# EAGLE design PSPS_AVNC_SRD_central-2020-11-2 (FABRICATED) (EAGLE 9.6.2)
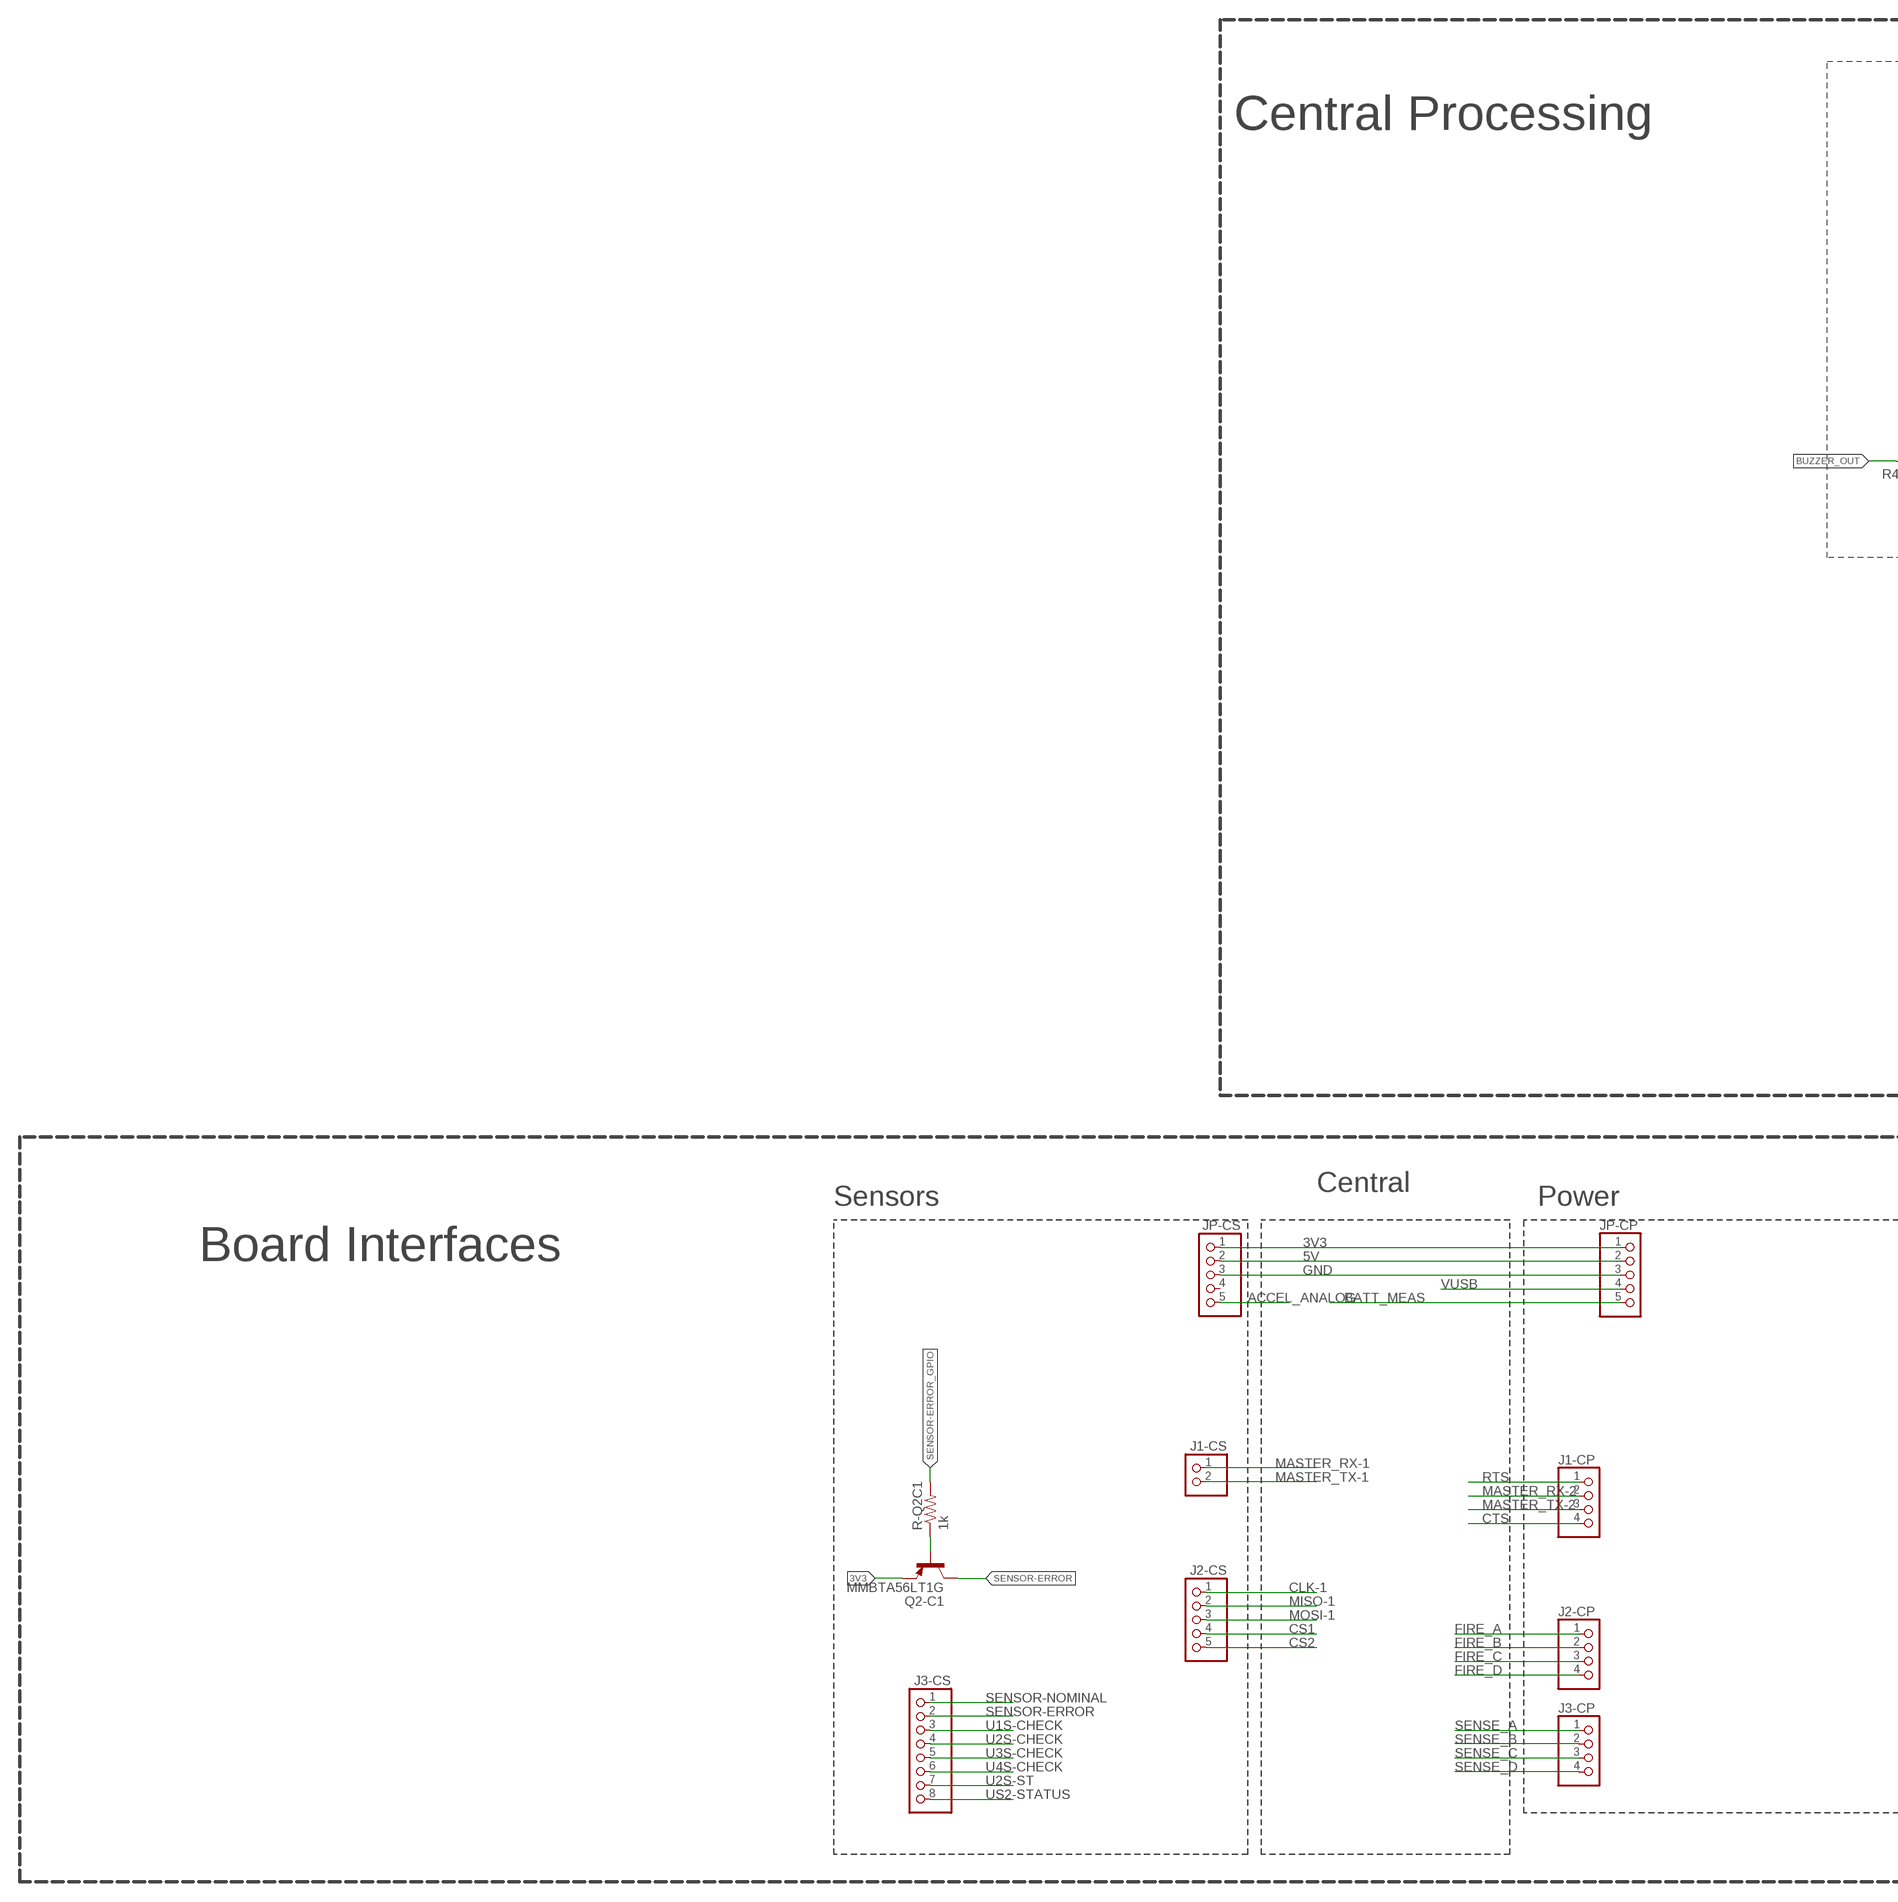
[diagram p0: schematic, sheet 1, part 1 of 2]
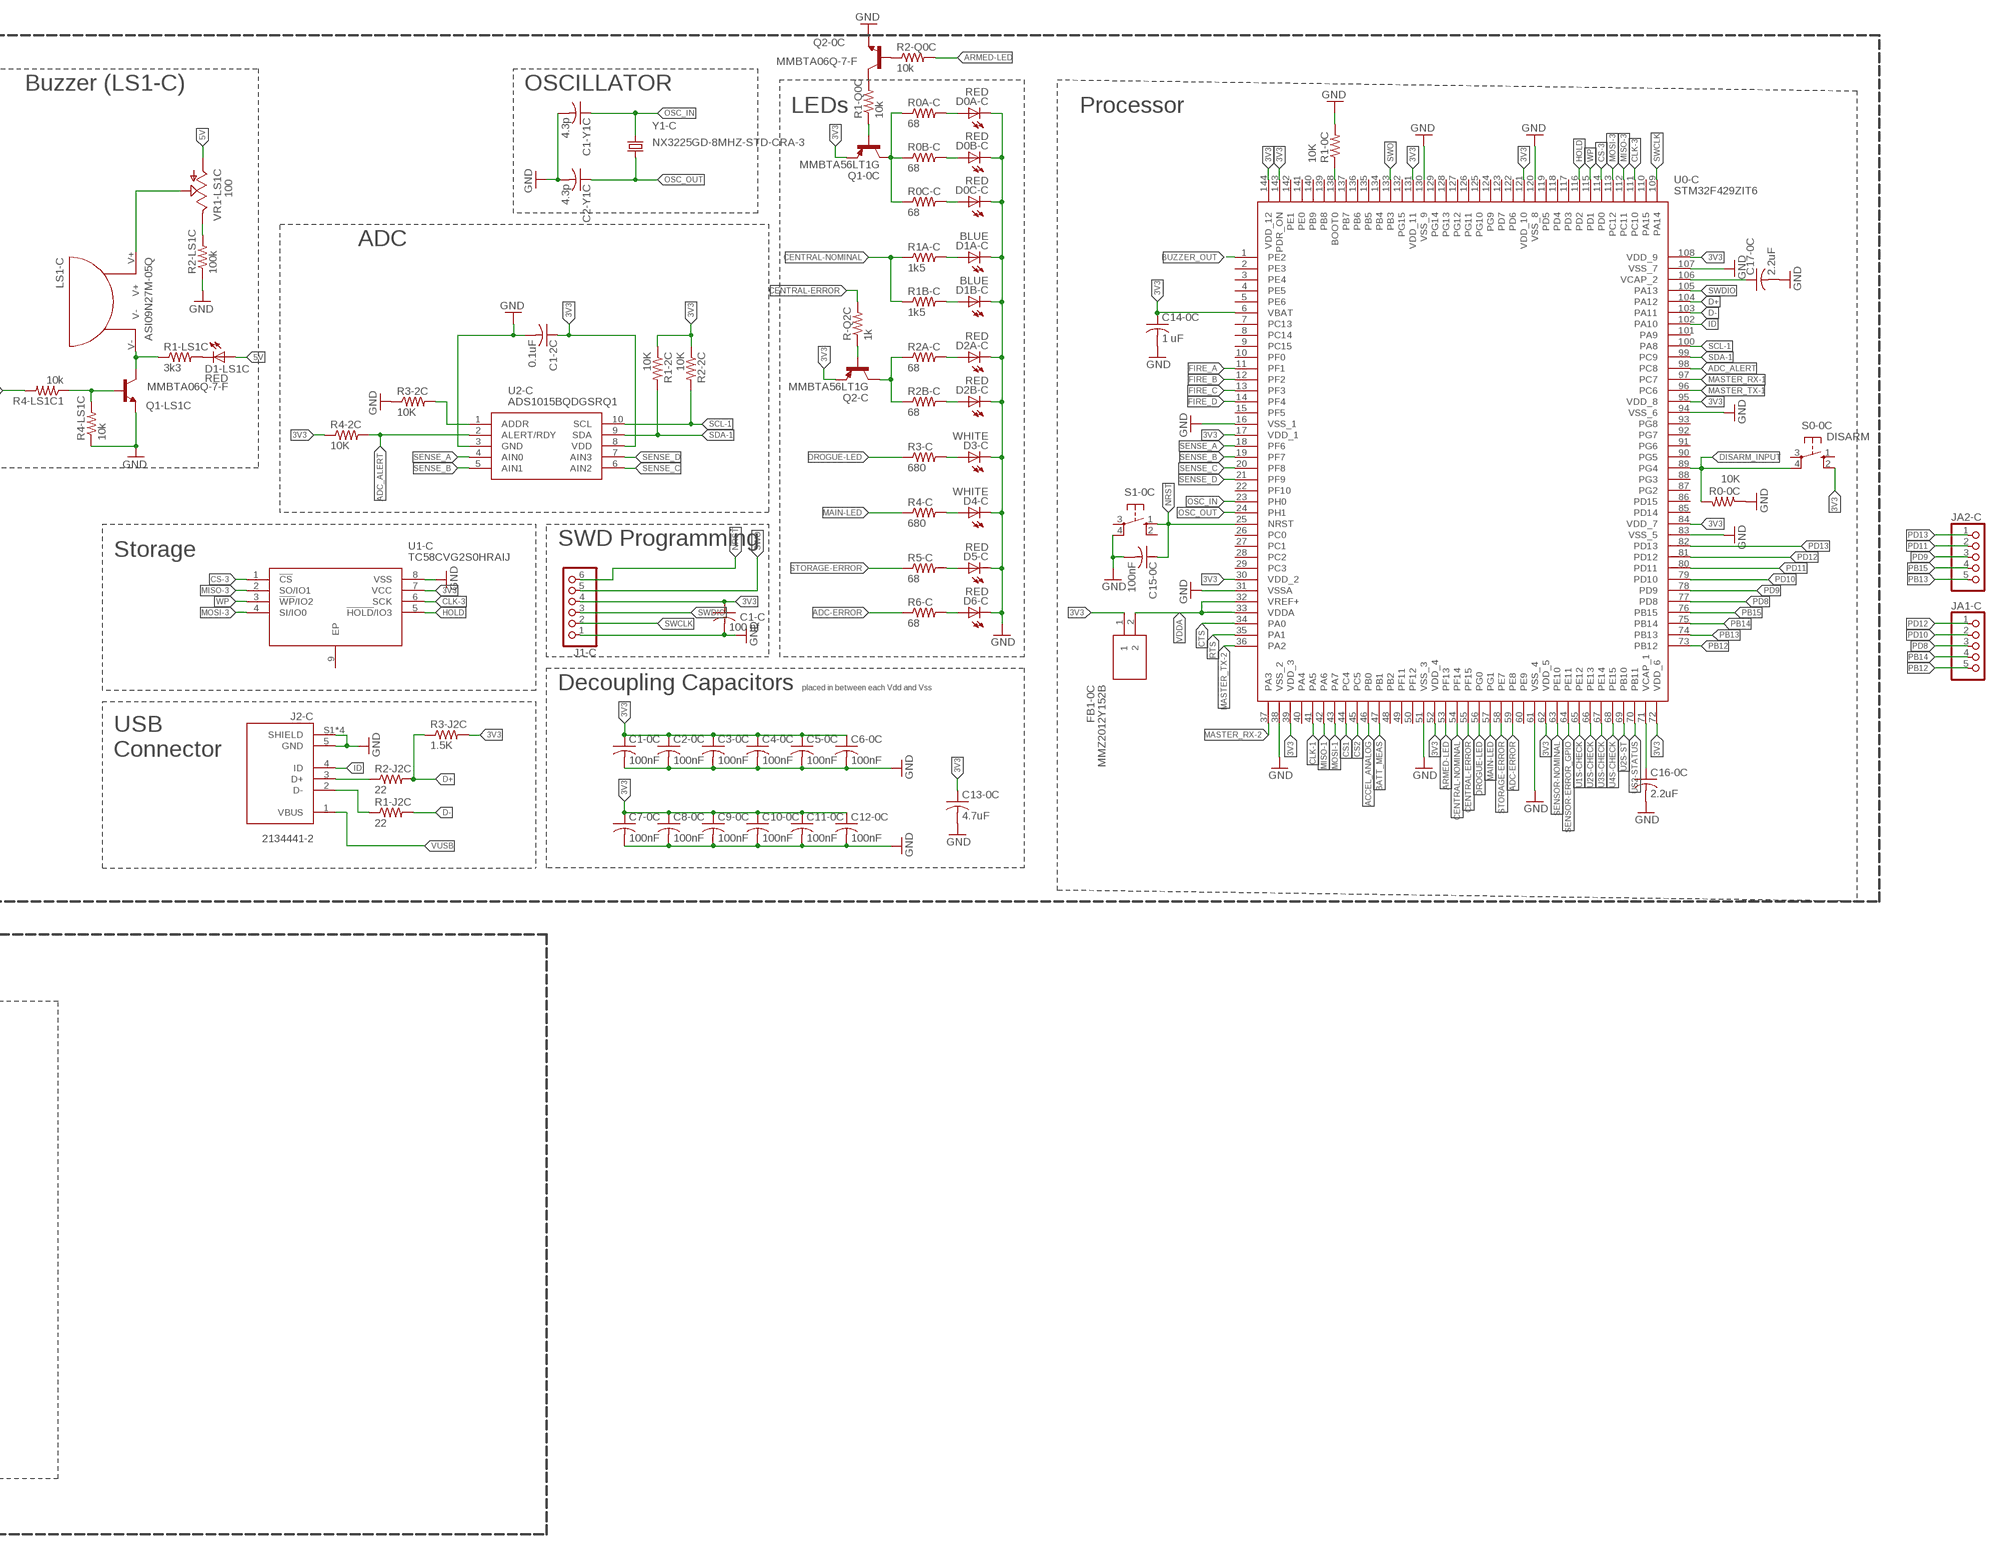
[diagram p1: schematic, sheet 1, part 2 of 2]

## Parts
C1-0C  100nF  C-USC0805  [C0805]
C1-2C  0.1uF  C-USC0805  [C0805]
C1-C  100 nf  C-USC0805  [C0805]
C1-Y1C  4.3p  C-USC0805  [C0805]
C2-0C  100nF  C-USC0805  [C0805]
C2-Y1C  4.3p  C-USC0805  [C0805]
C3-0C  100nF  C-USC0805  [C0805]
C4-0C  100nF  C-USC0805  [C0805]
C5-0C  100nF  C-USC0805  [C0805]
C6-0C  100nF  C-USC0805  [C0805]
C7-0C  100nF  C-USC0805  [C0805]
C8-0C  100nF  C-USC0805  [C0805]
C9-0C  100nF  C-USC0805  [C0805]
C10-0C  100nF  C-USC0805  [C0805]
C11-0C  100nF  C-USC0805  [C0805]
C12-0C  100nF  C-USC0805  [C0805]
C13-0C  4.7uF  C-USC0805  [C0805]
C14-0C  1 uF  C-USC0805  [C0805]
C15-0C  100nF  C-USC0805  [C0805]
C16-0C  2.2uF  C-USC0805  [C0805]
C17-0C  2.2uF  C-USC0805  [C0805]
D0A-C  RED  LEDCHIPLED_0805  [CHIPLED_0805]
D0B-C  RED  LEDCHIPLED_0805  [CHIPLED_0805]
D0C-C  RED  LEDCHIPLED_0805  [CHIPLED_0805]
D1-LS1C  RED  LEDCHIPLED_0805  [CHIPLED_0805]
D1A-C  BLUE  LEDCHIPLED_0805  [CHIPLED_0805]
D1B-C  BLUE  LEDCHIPLED_0805  [CHIPLED_0805]
D2A-C  RED  LEDCHIPLED_0805  [CHIPLED_0805]
D2B-C  RED  LEDCHIPLED_0805  [CHIPLED_0805]
D3-C  WHITE  LEDCHIPLED_0805  [CHIPLED_0805]
D4-C  WHITE  LEDCHIPLED_0805  [CHIPLED_0805]
D5-C  RED  LEDCHIPLED_0805  [CHIPLED_0805]
D6-C  RED  LEDCHIPLED_0805  [CHIPLED_0805]
FB1-0C  MMZ2012Y152B  [BEADC2012X105N]
J1-C  PINHD-1X6  [1X06]
J1-CP  PINHD-1X4  [1X04]
J1-CS  PINHD-1X2  [1X02]
J2-C  2134441-2  [TE_2134441-2]
J2-CP  PINHD-1X4  [1X04]
J2-CS  PINHD-1X5  [1X05]
J3-CP  PINHD-1X4  [1X04]
J3-CS  PINHD-1X8  [1X08]
JA1-C  PINHD-1X5  [1X05]
JA2-C  PINHD-1X5  [1X05]
JP-CP  PINHD-1X5  [1X05]
JP-CS  PINHD-1X5  [1X05]
LS1-C  ASI09N27M-05Q  [ASI09N27M-05Q]
Q1-0C  MMBTA56LT1G  PNP_TRANSISTOR  [SOT23]
Q1-LS1C  MMBTA06Q-7-F  NPN_TRANSISTOR  [SOT23]
Q2-0C  MMBTA06Q-7-F  NPN_TRANSISTOR  [SOT23]
Q2-C  MMBTA56LT1G  PNP_TRANSISTOR  [SOT23]
Q2-C1  MMBTA56LT1G  PNP_TRANSISTOR  [SOT23]
R0-0C  10K  R-US_R0805  [R0805]
R0A-C  68  R-US_M0805  [M0805]
R0B-C  68  R-US_M0805  [M0805]
R0C-C  68  R-US_M0805  [M0805]
R1-0C  10K  R-US_R0805  [R0805]
R1-2C  10K  R-US_R0805  [R0805]
R1-J2C  22  R-US_M0805  [M0805]
R1-LS1C  3k3  R-US_R0805  [R0805]
R1-Q0C  10k  R-US_M0805  [M0805]
R1A-C  1k5  R-US_M0805  [M0805]
R1B-C  1k5  R-US_M0805  [M0805]
R2-2C  10K  R-US_R0805  [R0805]
R2-J2C  22  R-US_M0805  [M0805]
R2-LS1C  100k  R-US_R0805  [R0805]
R2-Q0C  10k  R-US_M0805  [M0805]
R2A-C  68  R-US_M0805  [M0805]
R2B-C  68  R-US_M0805  [M0805]
R3-2C  10K  R-US_R0805  [R0805]
R3-C  680  R-US_M0805  [M0805]
R3-J2C  1.5K  R-US_M0805  [M0805]
R4-2C  10K  R-US_R0805  [R0805]
R4-C  680  R-US_M0805  [M0805]
R4-LS1C  10k  R-US_R0805  [R0805]
R4-LS1C1  10k  R-US_R0805  [R0805]
R5-C  68  R-US_M0805  [M0805]
R6-C  68  R-US_M0805  [M0805]
R-Q2C  1k  R-US_M0805  [M0805]
R-Q2C1  1k  R-US_M0805  [M0805]
S0-0C  DISARM  10-XX  [B3F-10XX]
S1-0C  10-XX  [B3F-10XX]
U0-C  STM32F429ZIT6  [QFP50P2200X2200X160-144N]
U1-C  TC58CVG2S0HRAIJ  [SON127P800X600X80-9N]
U2-C  ADS1015BQDGSRQ1  [SOP50P490X110-10N]
VR1-LS1C  100  TRIM_US-LI10  [LI10]
Y1-C  NX3225GD-8MHZ-STD-CRA-3  NX3225GD  [NX3225GD]

## Nets
3V3: C1-0C.1 C1-2C.1 C1-C.1 C2-0C.1 C3-0C.1 C4-0C.1 C5-0C.1 C6-0C.1 C7-0C.1 C8-0C.1 C9-0C.1 C10-0C.1 C11-0C.1 C12-0C.1 C13-0C.1 C14-0C.1 FB1-0C.1 J1-C.4 JP-CP.1 JP-CS.1 Q1-0C.2(E) Q2-C1.2(E) Q2-C.2(E) R1-2C.1 R2-2C.1 R3-J2C.2 R4-2C.1 S0-0C.2(S1) U0-C.6(VBAT) U0-C.17(VDD_1) U0-C.30(VDD_2) U0-C.39(VDD_3) U0-C.52(VDD_4) U0-C.62(VDD_5) U0-C.72(VDD_6) U0-C.84(VDD_7) U0-C.95(VDD_8) U0-C.108(VDD_9) U0-C.121(VDD_10) U0-C.131(VDD_11) U0-C.143(PDR_ON) U0-C.144(VDD_12) U1-C.7(VCC) U2-C.8(VDD)
5V: D1-LS1C.A JP-CP.2 JP-CS.2 VR1-LS1C.A
ACCEL_ANALOG: JP-CS.5 U0-C.46(PB0)
ADC-ERROR: R6-C.1 U0-C.59(PE8)
ADC_ALERT: R4-2C.2 U0-C.98(PC8) U2-C.2(ALERT/RDY)
ADDR: R3-2C.2 U2-C.1(ADDR)
ARMED-LED: R2-Q0C.2 U0-C.53(PF13)
BATT_MEAS: JP-CP.5 U0-C.47(PB1)
BOOT0: R1-0C.1 U0-C.138(BOOT0)
BUZZER_OUT: R4-LS1C1.2 U0-C.1(PE2)
CENTRAL-ERROR: R-Q2C.2 U0-C.55(PF15)
CENTRAL-NOMINAL: R1A-C.1 R1B-C.1 U0-C.54(PF14)
CLK-1: J2-CS.1 U0-C.41(PA5)
CLK-3: U0-C.111(PC10) U1-C.6(SCK)
CS1: J2-CS.4 U0-C.44(PC4)
CS2: J2-CS.5 U0-C.45(PC5)
CS-3: U0-C.114(PD0) U1-C.1(!CS)
CTS: J1-CP.4 U0-C.34(PA0)
D1-LS1C_R1-LS1C: D1-LS1C.C R1-LS1C.2
D+: R2-J2C.2 R3-J2C.1 U0-C.104(PA12)
D+_R2-J1C: J2-C.3(D+) R2-J2C.1
D-: R1-J2C.2 U0-C.103(PA11)
D-_R1-J1C: J2-C.2(D-) R1-J2C.1
DISARM_INPUT: R0-0C.2 S0-0C.4(P1) U0-C.89(PG4)
DROGUE-LED: R3-C.1 U0-C.56(PG0)
FIRE_A: J2-CP.1 U0-C.11(PF1)
FIRE_B: J2-CP.2 U0-C.12(PF2)
FIRE_C: J2-CP.3 U0-C.13(PF3)
FIRE_D: J2-CP.4 U0-C.14(PF4)
GND: C1-0C.2 C1-2C.2 C1-C.2 C1-Y1C.2 C2-0C.2 C2-Y1C.2 C3-0C.2 C4-0C.2 C5-0C.2 C6-0C.2 C7-0C.2 C8-0C.2 C9-0C.2 C10-0C.2 C11-0C.2 C12-0C.2 C13-0C.2 C14-0C.2 C15-0C.2 C16-0C.2 C17-0C.2 D0A-C.C D0B-C.C D0C-C.C D1A-C.C D1B-C.C D2A-C.C D2B-C.C D3-C.C D4-C.C D5-C.C D6-C.C J1-C.1 J2-C.5(GND) J2-C.S1(SHIELD) J2-C.S2(SHIELD) J2-C.S3(SHIELD) J2-C.S4(SHIELD) JP-CP.3 JP-CS.3 Q1-LS1C.3(E) Q2-0C.3(E) R0-0C.1 R1-0C.2 R2-LS1C.1 R3-2C.1 R4-LS1C.1 S1-0C.4(P1) U0-C.16(VSS_1) U0-C.31(VSSA) U0-C.38(VSS_2) U0-C.51(VSS_3) U0-C.61(VSS_4) U0-C.83(VSS_5) U0-C.94(VSS_6) U0-C.107(VSS_7) U0-C.120(VSS_8) U0-C.130(VSS_9) U1-C.8(VSS) U2-C.3(GND)
HOLD: U0-C.116(PD2) U1-C.5(!HOLD!/IO3)
ID: J2-C.4(ID) U0-C.102(PA10)
LS1-C_Q1-LS1C: LS1-C.V- Q1-LS1C.2(C) R1-LS1C.1
MAIN-LED: R4-C.1 U0-C.57(PG1)
MASTER_RX-1: J1-CS.1 U0-C.97(PC7)
MASTER_RX-2: J1-CP.2 U0-C.37(PA3)
MASTER_TX-1: J1-CS.2 U0-C.96(PC6)
MASTER_TX-2: J1-CP.3 U0-C.36(PA2)
MISO-1: J2-CS.2 U0-C.42(PA6)
MISO-3: U0-C.112(PC11) U1-C.2(SO/IO1)
MOSI-1: J2-CS.3 U0-C.43(PA7)
MOSI-3: U0-C.113(PC12) U1-C.4(SI/IO0)
N$7: Q2-C1.1(B) R-Q2C1.1
NRST: C15-0C.1 J1-C.6 S1-0C.1(S) U0-C.25(NRST)
OSC_IN: C1-Y1C.1 U0-C.23(PH0) Y1-C.P$2
OSC_OUT: C2-Y1C.1 U0-C.24(PH1) Y1-C.P$1
PB12: JA1-C.5 U0-C.73(PB12)
PB13: JA2-C.5 U0-C.74(PB13)
PB14: JA1-C.4 U0-C.75(PB14)
PB15: JA2-C.4 U0-C.76(PB15)
PD8: JA1-C.3 U0-C.77(PD8)
PD9: JA2-C.3 U0-C.78(PD9)
PD10: JA1-C.2 U0-C.79(PD10)
PD11: JA2-C.2 U0-C.80(PD11)
PD12: JA1-C.1 U0-C.81(PD12)
PD13: JA2-C.1 U0-C.82(PD13)
Q0-C_R0-C: Q1-0C.3(C) R0A-C.1 R0B-C.1 R0C-C.1
Q1-0C_R-1Q0C: Q1-0C.1(B) R1-Q0C.1
Q2-C_R2-C: Q2-C.3(C) R2A-C.1 R2B-C.1
R0A-C_D0A-C: D0A-C.A R0A-C.2
R0B-C_D0B-C: D0B-C.A R0B-C.2
R0C-C_D0C-C: D0C-C.A R0C-C.2
R1-Q0C_Q2-0C: Q2-0C.2(C) R1-Q0C.2
R1A-C_D1A-C: D1A-C.A R1A-C.2
R1B-C_D1B-C: D1B-C.A R1B-C.2
R2-LS1C_LS1C: LS1-C.V+ VR1-LS1C.S
R2-Q0C_Q2-0C: Q2-0C.1(B) R2-Q0C.1
R2A-C_D2A-C: D2A-C.A R2A-C.2
R2B-C_D2B-C: D2B-C.A R2B-C.2
R3-C_D3-C: D3-C.A R3-C.2
R3-LS1C_Q1-LS1C: Q1-LS1C.1(B) R4-LS1C1.1 R4-LS1C.2
R4-C_D4-C: D4-C.A R4-C.2
R5-C_D5-C: D5-C.A R5-C.2
R6-C_D6-C: D6-C.A R6-C.2
R-Q2C_Q2-C: Q2-C.1(B) R-Q2C.1
RTS: J1-CP.1 U0-C.35(PA1)
SCL-1: R2-2C.2 U0-C.100(PA8) U2-C.10(SCL)
SDA-1: R1-2C.2 U0-C.99(PC9) U2-C.9(SDA)
SENSE_A: J3-CP.1 U0-C.18(PF6) U2-C.4(AIN0)
SENSE_B: J3-CP.2 U0-C.19(PF7) U2-C.5(AIN1)
SENSE_C: J3-CP.3 U0-C.20(PF8) U2-C.6(AIN2)
SENSE_D: J3-CP.4 U0-C.21(PF9) U2-C.7(AIN3)
SENSOR-ERROR: J3-CS.2 Q2-C1.3(C)
SENSOR-ERROR_GPIO: R-Q2C1.2 U0-C.64(PE11)
SENSOR-NOMINAL: J3-CS.1 U0-C.63(PE10)
STORAGE-ERROR: R5-C.1 U0-C.58(PE7)
SWCLK: J1-C.2 U0-C.109(PA14)
SWDIO: J1-C.3 U0-C.105(PA13)
SWO: J1-C.5 U0-C.133(PB3)
U1S-CHECK: J3-CS.3 U0-C.65(PE12)
U2S-CHECK: J3-CS.4 U0-C.66(PE13)
U2S-ST: J3-CS.7 U0-C.69(PB10)
U3S-CHECK: J3-CS.5 U0-C.67(PE14)
U4S-CHECK: J3-CS.6 U0-C.68(PE15)
US2-STATUS: J3-CS.8 U0-C.70(PB11)
VCAP_1: C16-0C.1 U0-C.71(VCAP_1)
VCAP_2: C17-0C.1 U0-C.106(VCAP_2)
VDDA: FB1-0C.2 U0-C.32(VREF+) U0-C.33(VDDA)
VR1-LS1C_R3-LS1C: R2-LS1C.2 VR1-LS1C.E
VUSB: J2-C.1(VBUS) JP-CP.4
WP: U0-C.115(PD1) U1-C.3(!WP!/IO2)
Unconnected: JP-CS.4 S0-0C.1(S) S0-0C.3(P) S1-0C.2(S1) S1-0C.3(P) U0-C.2(PE3) U0-C.3(PE4) U0-C.4(PE5) U0-C.5(PE6) U0-C.7(PC13) U0-C.8(PC14) U0-C.9(PC15) U0-C.10(PF0) U0-C.15(PF5) U0-C.22(PF10) U0-C.26(PC0) U0-C.27(PC1) U0-C.28(PC2) U0-C.29(PC3) U0-C.40(PA4) U0-C.48(PB2) U0-C.49(PF11) U0-C.50(PF12) U0-C.60(PE9) U0-C.85(PD14) U0-C.86(PD15) U0-C.87(PG2) U0-C.88(PG3) U0-C.90(PG5) U0-C.91(PG6) U0-C.92(PG7) U0-C.93(PG8) U0-C.101(PA9) U0-C.110(PA15) U0-C.117(PD3) U0-C.118(PD4) U0-C.119(PD5) U0-C.122(PD6) U0-C.123(PD7) U0-C.124(PG9) U0-C.125(PG10) U0-C.126(PG11) U0-C.127(PG12) U0-C.128(PG13) U0-C.129(PG14) U0-C.132(PG15) U0-C.134(PB4) U0-C.135(PB5) U0-C.136(PB6) U0-C.137(PB7) U0-C.139(PB8) U0-C.140(PB9) U0-C.141(PE0) U0-C.142(PE1) U1-C.9(EP)

## Notes on the sheet
- Buzzer (LS1-C) | OSCILLATOR
- LEDs | Processor
- Central Processing
- ADC
- SWD Programming
- Storage
- Decoupling Capacitors | placed in between each Vdd and Vss
- USB 
  Connector
- Central
- Sensors | Power
- Board Interfaces

## Library data of the parts
C1-0C C1-2C C1-C C1-Y1C C2-0C C2-Y1C C3-0C C4-0C C5-0C C6-0C C7-0C C8-0C C9-0C C10-0C C11-0C C12-0C C13-0C C14-0C C15-0C C16-0C C17-0C = rcl:C-US: CAPACITOR, American symbol; SPICEPREFIX: C
D0A-C D0B-C D0C-C D1-LS1C D1A-C D1B-C D2A-C D2B-C D3-C D4-C D5-C D6-C = adafruit:LED: LED OSRAM: - CHIPLED LG R971, LG N971, LY N971, LG Q971, LY Q971, LO R971, LY R971 LH N974, LH R974 LS Q976, LO Q976, LY Q976 LO Q996 - Hyper CHIPLED LW Q18S LB Q993, LB Q99A, LB R99A - SideLED LS A670, LO A670, LY A670, LG A670, LP A670 LB A673, LV A673, LT A673, LW A673 LH A674 LY A675 LS A676, LA A676, LO A676, LY A676, LW A676 LS A679, LY A679, LG A679 - Hyper Micro SIDELED® LS Y876, LA Y876, LO Y876, LY Y876 LT Y87S - SmartLED LW L88C, LW L88S LB L89C, LB L89S, LG L890 LS L89K, LO L89K, LY L89K LS L896, LA L896, LO L896, LY L896 - TOPLED LS T670, LO T670, LY T670, LG T670, LP T670 LSG T670, LSP T670, LSY T670, LOP T670, LYG T670 LG T671, LOG T671, LSG T671 LB T673, LV T673, LT T673, LW T673 LH T674 LS T676, LA T676, LO T676, LY T676, LB T676, LH T676, LSB T676, LW T676 LB T67C, LV T67C, LT T67C, LS T67K, LO T67K, LY T67K, LW E67C LS E67B, LA E67B, LO E67B, LY E67B, LB E67C, LV E67C, LT E67C LW T67C LS T679, LY T679, LG T679 LS T770, LO T770, LY T770, LG T770, LP T770 LB T773, LV T773, LT T773, LW T773 LH T774 LS E675, LA E675, LY E675, LS T675 LS T776, LA T776, LO T776, LY T776, LB T776 LHGB T686 LT T68C, LB T68C - Hyper Mini TOPLED® LB M676 - Mini TOPLED Santana® LG M470 LS M47K, LO M47K, LY M47K Source: http://www.osram.convergy.de/
FB1-0C = SamacSys_Parts:MMZ2012Y152B: Ferrite bead SMD 1500Ohm 500mA TDK Ferrite Bead (Chip Bead), 2 x 1.25 x 0.85mm (0805) Source: Datasheet <https://componentsearchengine.com/Datasheets/1/MMZ2012Y152B.pdf>; DESCRIPTION: Ferrite bead SMD 1500Ohm 500mA TDK Ferrite Bead (Chip Bead), 2 x 1.25 x 0.85mm (0805); HEIGHT: 1.05mm; MANUFACTURER_NAME: TDK; MANUFACTURER_PART_NUMBER: MMZ2012Y152B; MOUSER_PART_NUMBER: 810-MMZ2012Y152B; MOUSER_PRICE-STOCK: https://www.mouser.com/Search/Refine.aspx?Keyword=810-MMZ2012Y152B
J1-C = pinhead:PINHD-1X6: PIN HEADER
J1-CP J2-CP J3-CP = pinhead:PINHD-1X4: PIN HEADER
J1-CS = pinhead:PINHD-1X2: PIN HEADER
J2-C = 2134441-2:2134441-2: Conn Micro USB RCP 5 POS 0.65mm Solder RA SMD 5 Terminal 1 Port T/R; COMMENT: 2134441-2; DESCRIPTION: Conn Micro USB RCP 5 POS 0.65mm Solder RA SMD 5 Terminal 1 Port T/R; DIGI-KEY_PART_NUMBER: A118104CT-ND; DIGI-KEY_PURCHASE_URL: https://www.digikey.com/product-detail/en/te-connectivity-amp-connectors/2134441-2/A118104CT-ND/4729911?utm_source=snapeda&utm_medium=aggregator&utm_campaign=symbol; MF: TE Connectivity; MP: 2134441-2; PACKAGE: None; TE_PURCHASE_URL: https://www.te.com/usa-en/product-2134441-2.html?te_bu=Cor&te_type=disp&te_campaign=seda_glo_cor-seda-global-disp-prtnr-fy19-seda-model-bom-cta_sma-317_1&elqCampaignId=32493
J2-CS JA1-C JA2-C JP-CP JP-CS = pinhead:PINHD-1X5: PIN HEADER
J3-CS = pinhead:PINHD-1X8: PIN HEADER
LS1-C = Computer2:ASI09N27M-05Q
Q1-0C Q2-C Q2-C1 = Flight Computer Parts:PNP_TRANSISTOR
Q1-LS1C Q2-0C = Flight Computer Parts:NPN_TRANSISTOR
R0-0C R0A-C R0B-C R0C-C R1-0C R1-2C R1-J2C R1-Q0C R1A-C R1B-C R2-2C R2-J2C R2-Q0C R2A-C R2B-C R3-2C R3-C R3-J2C R4-2C R4-C R5-C R6-C R-Q2C R-Q2C1 = rcl:R-US_: RESISTOR, American symbol; SPICEPREFIX: R
R1-LS1C R2-LS1C R4-LS1C R4-LS1C1 = resistor:R-US_: RESISTOR, American symbol
S0-0C S1-0C = switch-omron:10-XX: OMRON SWITCH; MPN: B3F-1000; OC_FARNELL: 176432; OC_NEWARK: 36M3542
U0-C = SamacSys_Parts:STM32F429ZIT6: 32-Bit MCU+FPU M4 2MB LCD-TFT LQFP144 STMicroelectronics STM32F429ZIT6, 32bit ARM Cortex M4 MCU, 180MHz, 2048 kB Flash, 144-Pin LQFP Source: Datasheet <https://componentsearchengine.com/Datasheets/1/STM32F429ZIT6.pdf>; DESCRIPTION: 32-Bit MCU+FPU M4 2MB LCD-TFT LQFP144 STMicroelectronics STM32F429ZIT6, 32bit ARM Cortex M4 MCU, 180MHz, 2048 kB Flash, 144-Pin LQFP; HEIGHT: 1.6mm; MANUFACTURER_NAME: STMicroelectronics; MANUFACTURER_PART_NUMBER: STM32F429ZIT6; MOUSER_PART_NUMBER: 511-STM32F429ZIT6; MOUSER_PRICE-STOCK: https://www.mouser.com/Search/Refine.aspx?Keyword=511-STM32F429ZIT6
U1-C = SamacSys_Parts:TC58CVG2S0HRAIJ: NAND Flash 4G-bit 128M X 8bit Serial 8-Pin WSON Source: Datasheet <https://business.kioxia.com/en-us/memory/detail.TC58CVG2S0HRAIJ.html>; DESCRIPTION: NAND Flash 4G-bit 128M X 8bit Serial 8-Pin WSON; HEIGHT: 0.8mm; MANUFACTURER_NAME: Kioxia America; MANUFACTURER_PART_NUMBER: TC58CVG2S0HRAIJ; MOUSER_PART_NUMBER: 757-TC58CVG2S0HRAIJ; MOUSER_PRICE-STOCK: https://www.mouser.co.uk/ProductDetail/Kioxia-America/TC58CVG2S0HRAIJ?qs=OlC7AqGiEDkQEWU%2FaAG3Ug%3D%3D
U2-C = SamacSys_Parts:ADS1015BQDGSRQ1: Automotive 12-Bit 3.3kSPS 4-Ch Delta-Sigma ADC With PGA, Oscillator, VREF, Comparator, and I2C Source: Datasheet <http://www.ti.com/lit/gpn/ads1015-q1>; DESCRIPTION: Automotive 12-Bit 3.3kSPS 4-Ch Delta-Sigma ADC With PGA, Oscillator, VREF, Comparator, and I2C; HEIGHT: 1.1mm; MANUFACTURER_NAME: Texas Instruments; MANUFACTURER_PART_NUMBER: ADS1015BQDGSRQ1; MOUSER_PART_NUMBER: 595-ADS1015BQDGSRQ1; MOUSER_PRICE-STOCK: https://www.mouser.com/Search/Refine.aspx?Keyword=595-ADS1015BQDGSRQ1
VR1-LS1C = pot:TRIM_US-: POTENTIOMETER
Y1-C = MarkParts:NX3225GD

## Board
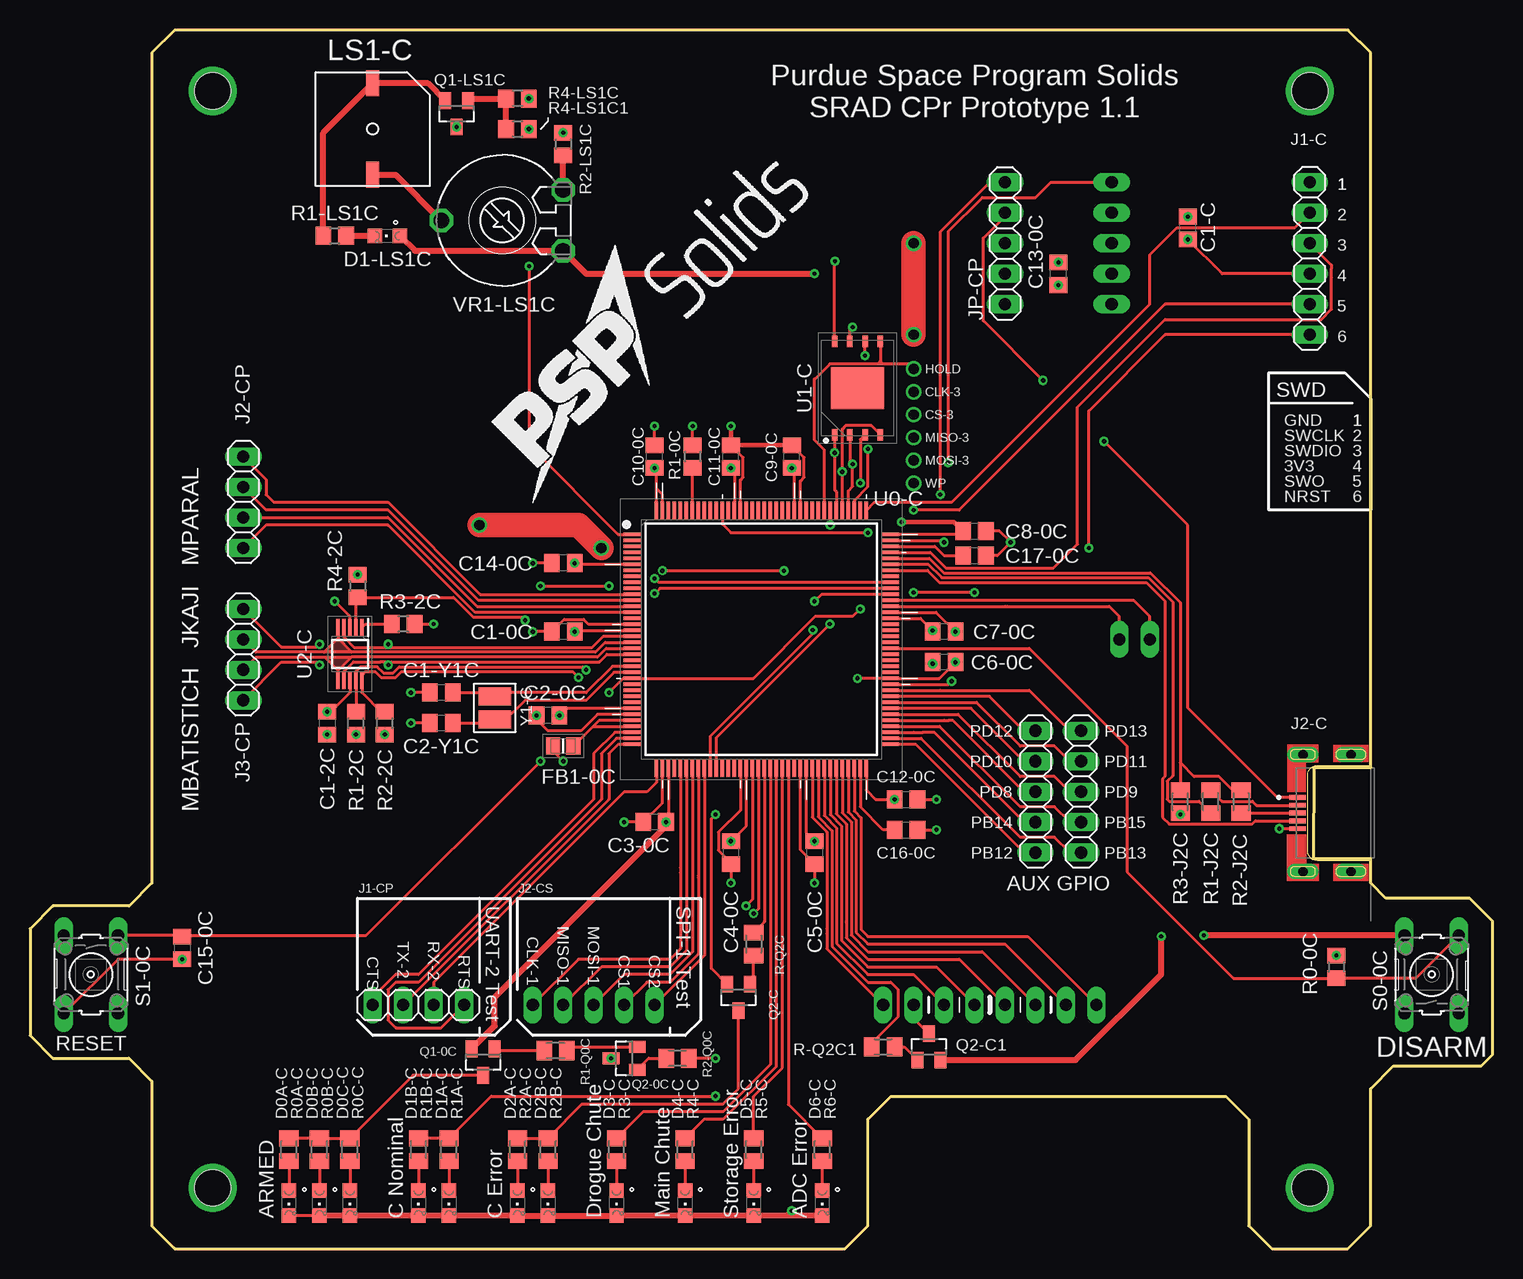
[diagram p2: board, top side]
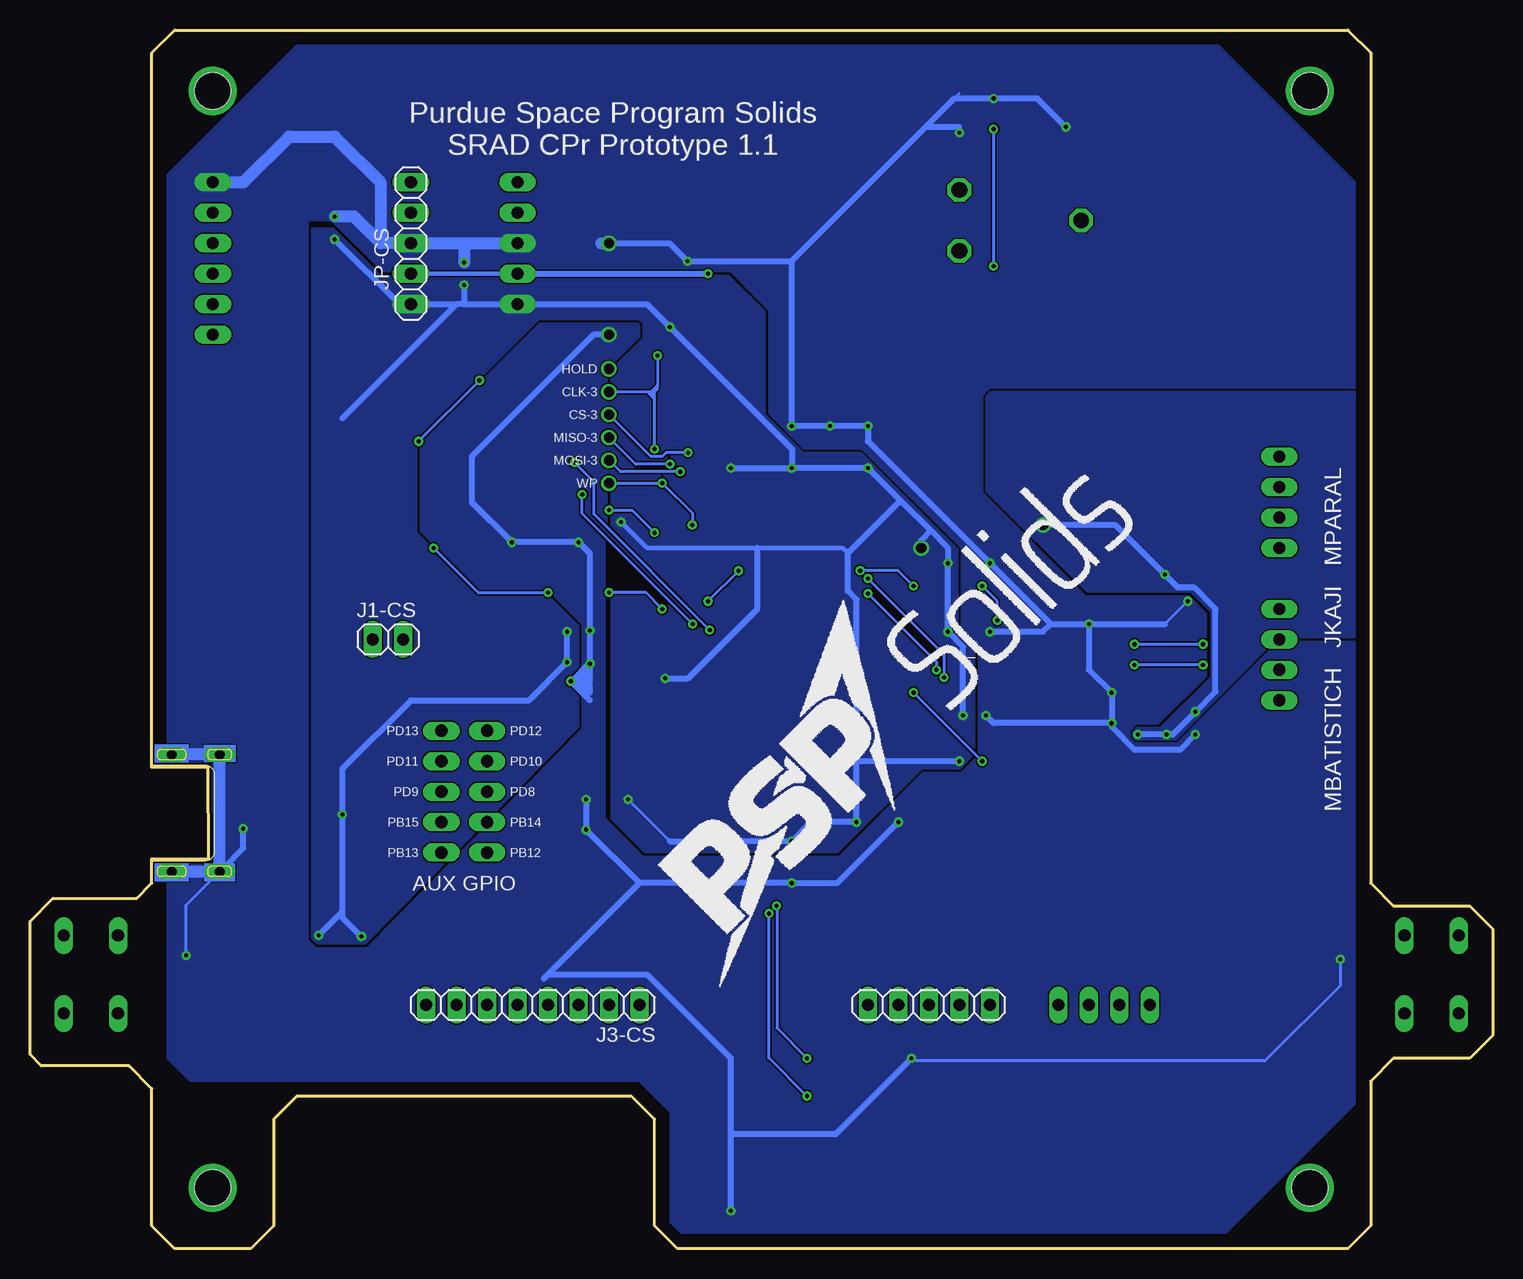
[diagram p3: board, bottom side, seen from below]

Size 121.92 x 101.6 mm. Coordinates in mm from the lower left corner, seen from the top.
Outline: 10.16,1.91 12.06,0 67.94,0 69.85,1.91 69.85,10.79 71.75,12.7 99.69,12.7 101.6,10.79 101.6,1.91 103.5,0 109.85,0 111.76,1.91 111.76,13.34 113.66,15.24 120.97,15.24 121.92,16.19 121.92,27.3 120.02,29.21 113.03,29.21 111.76,30.48 111.76,32.51 107.02,32.51 107.05,40.13 111.78,40.13 111.76,99.69 109.85,101.6 12.06,101.6 10.16,99.69 10.16,30.48 8.26,28.57 1.9,28.57 0,26.67 0,17.78 1.9,15.88 8.26,15.88 10.16,13.97 10.16,1.91
Copper layers (1*16): Top 0.035mm / dielectric 1.5mm / Bottom 0.035mm
Design rules "default *": minimum track width 6mil, minimum drill 0.35mm, track to track 5mil, track to pad 5mil, pad to pad 5mil, via to via 5mil, smd to smd 5mil, copper to edge 10mil, drill to drill 6mil, minimum pad ring 10mil, minimum via ring 8mil, stop-mask expansion 4mil, vias tented up to drill 0mil, thermal gap 10mil
Holes 3 mm at 15.24,96.52 106.68,96.52 106.68,5.08 15.24,5.08

### Footprints (pad centres in the part's own frame; a part is rotated, then mirrored left to right if it is on the bottom)
C0805 = smd 1.3 x 1.5: 1 -0.95,0; 2 0.95,0
CHIPLED_0805 = smd 1.2 x 1.2: A 0,-1.05; C 0,1.05
BEADC2012X105N = smd 1.2 x 1.45: 1 -0.85,0; 2 0.85,0
1X06 = drill 1.016 long: 1 -6.35,0; 2 -3.81,0; 3 -1.27,0; 4 1.27,0; 5 3.81,0; 6 6.35,0
1X04 = drill 1.016 long: 1 -3.81,0; 2 -1.27,0; 3 1.27,0; 4 3.81,0
1X02 = drill 1.016 long: 1 -1.27,0; 2 1.27,0
TE_2134441-2 = smd 1.4 x 0.4: 1 -4.45,1.3; 2 -4.45,0.65; 3 -4.45,0; 4 -4.45,-0.65; 5 -4.45,-1.3 | drill 0.8 pad 1.25 long: S1 -4,-4.875; S2 0,-4.875; S3 0,4.875; S4 -4,4.875
1X05 = drill 1.016 long: 1 -5.08,0; 2 -2.54,0; 3 0,0; 4 2.54,0; 5 5.08,0
1X08 = drill 1.016 long: 1 -8.89,0; 2 -6.35,0; 3 -3.81,0; 4 -1.27,0; 5 1.27,0; 6 3.81,0; 7 6.35,0; 8 8.89,0
ASI09N27M-05Q = smd 2.184 x 1.067: V+ 3.81,0; V- -3.81,0
SOT23 = smd 1 x 1.4: 1 -0.95,-1.1; 2 0.95,-1.1; 3 0,1.1
R0805 = smd 1.3 x 1.5: 1 -0.95,0; 2 0.95,0
M0805 = smd 1.3 x 1.6: 1 -0.95,0; 2 0.95,0
B3F-10XX = drill 1.016 long: 1 -3.251,2.261; 2 3.251,2.261; 3 -3.251,-2.261; 4 3.251,-2.261
QFP50P2200X2200X160-144N = smd 1.475 x 0.3: 1 -10.738,8.75; 2 -10.738,8.25; 3 -10.738,7.75; 4 -10.738,7.25; 5 -10.738,6.75; 6 -10.738,6.25; 7 -10.738,5.75; 8 -10.738,5.25; 9 -10.738,4.75; 10 -10.738,4.25; 11 -10.738,3.75; 12 -10.738,3.25; 13 -10.738,2.75; 14 -10.738,2.25; 15 -10.738,1.75; 16 -10.738,1.25; 17 -10.738,0.75; 18 -10.738,0.25; 19 -10.738,-0.25; 20 -10.738,-0.75; 21 -10.738,-1.25; 22 -10.738,-1.75; 23 -10.738,-2.25; 24 -10.738,-2.75; 25 -10.738,-3.25; 26 -10.738,-3.75; 27 -10.738,-4.25; 28 -10.738,-4.75; 29 -10.738,-5.25; 30 -10.738,-5.75; 31 -10.738,-6.25; 32 -10.738,-6.75; 33 -10.738,-7.25; 34 -10.738,-7.75; 35 -10.738,-8.25; 36 -10.738,-8.75; 73 10.738,-8.75; 74 10.738,-8.25; 75 10.738,-7.75; 76 10.738,-7.25; 77 10.738,-6.75; 78 10.738,-6.25; 79 10.738,-5.75; 80 10.738,-5.25; 81 10.738,-4.75; 82 10.738,-4.25; 83 10.738,-3.75; 84 10.738,-3.25; 85 10.738,-2.75; 86 10.738,-2.25; 87 10.738,-1.75; 88 10.738,-1.25; 89 10.738,-0.75; 90 10.738,-0.25; 91 10.738,0.25; 92 10.738,0.75; 93 10.738,1.25; 94 10.738,1.75; 95 10.738,2.25; 96 10.738,2.75; 97 10.738,3.25; 98 10.738,3.75; 99 10.738,4.25; 100 10.738,4.75; 101 10.738,5.25; 102 10.738,5.75; 103 10.738,6.25; 104 10.738,6.75; 105 10.738,7.25; 106 10.738,7.75; 107 10.738,8.25; 108 10.738,8.75 | smd 0.3 x 1.475: 37 -8.75,-10.738; 38 -8.25,-10.738; 39 -7.75,-10.738; 40 -7.25,-10.738; 41 -6.75,-10.738; 42 -6.25,-10.738; 43 -5.75,-10.738; 44 -5.25,-10.738; 45 -4.75,-10.738; 46 -4.25,-10.738; 47 -3.75,-10.738; 48 -3.25,-10.738; 49 -2.75,-10.738; 50 -2.25,-10.738; 51 -1.75,-10.738; 52 -1.25,-10.738; 53 -0.75,-10.738; 54 -0.25,-10.738; 55 0.25,-10.738; 56 0.75,-10.738; 57 1.25,-10.738; 58 1.75,-10.738; 59 2.25,-10.738; 60 2.75,-10.738; 61 3.25,-10.738; 62 3.75,-10.738; 63 4.25,-10.738; 64 4.75,-10.738; 65 5.25,-10.738; 66 5.75,-10.738; 67 6.25,-10.738; 68 6.75,-10.738; 69 7.25,-10.738; 70 7.75,-10.738; 71 8.25,-10.738; 72 8.75,-10.738; 109 8.75,10.738; 110 8.25,10.738; 111 7.75,10.738; 112 7.25,10.738; 113 6.75,10.738; 114 6.25,10.738; 115 5.75,10.738; 116 5.25,10.738; 117 4.75,10.738; 118 4.25,10.738; 119 3.75,10.738; 120 3.25,10.738; 121 2.75,10.738; 122 2.25,10.738; 123 1.75,10.738; 124 1.25,10.738; 125 0.75,10.738; 126 0.25,10.738; 127 -0.25,10.738; 128 -0.75,10.738; 129 -1.25,10.738; 130 -1.75,10.738; 131 -2.25,10.738; 132 -2.75,10.738; 133 -3.25,10.738; 134 -3.75,10.738; 135 -4.25,10.738; 136 -4.75,10.738; 137 -5.25,10.738; 138 -5.75,10.738; 139 -6.25,10.738; 140 -6.75,10.738; 141 -7.25,10.738; 142 -7.75,10.738; 143 -8.25,10.738; 144 -8.75,10.738
SON127P800X600X80-9N = smd 0.95 x 0.45: 1 -3.9,1.905; 2 -3.9,0.635; 3 -3.9,-0.635; 4 -3.9,-1.905; 5 3.9,-1.905; 6 3.9,-0.635; 7 3.9,0.635; 8 3.9,1.905 | smd 3.5 x 4.4: 9 0,0
SOP50P490X110-10N = smd 1.4 x 0.3: 1 -2.2,1; 2 -2.2,0.5; 3 -2.2,0; 4 -2.2,-0.5; 5 -2.2,-1; 6 2.2,-1; 7 2.2,-0.5; 8 2.2,0; 9 2.2,0.5; 10 2.2,1
LI10 = drill 1.321 octagon: A -2.54,-5.08; E 2.54,-5.08; S 0,5.08
NX3225GD = smd 1.5 x 2.7: P$1 -0.95,0; P$2 0.95,0

### Placement (x,y rotation side)
C1-0C  44.45,51.44 180 top
C1-2C  24.77,43.81 270 top
C1-C  96.52,85.09 90 top
C1-Y1C  34.29,46.35 180 top
C2-0C  43.18,44.45 180 top
C2-Y1C  34.29,43.81 180 top
C3-0C  52.07,35.56 180 top
C4-0C  58.42,33.02 270 top
C5-0C  65.41,33.02 270 top
C6-0C  76.2,48.9 180 top
C7-0C  76.2,51.44 180 top
C8-0C  78.74,59.82 0 top
C9-0C  63.5,66.04 90 top
C10-0C  52.07,66.04 90 top
C11-0C  58.42,66.04 90 top
C12-0C  73.03,37.47 0 top
C13-0C  85.72,81.28 90 top
C14-0C  44.45,57.15 180 top
C15-0C  12.7,25.08 270 top
C16-0C  73.03,34.92 0 top
C17-0C  78.74,57.78 0 top
D0A-C  21.59,3.81 180 top
D0B-C  24.13,3.81 180 top
D0C-C  26.67,3.81 180 top
D1-LS1C  29.79,84.43 90 top
D1A-C  34.92,3.81 180 top
D1B-C  32.39,3.81 180 top
D2A-C  40.64,3.81 180 top
D2B-C  43.18,3.81 180 top
D3-C  48.89,3.81 180 top
D4-C  54.61,3.81 180 top
D5-C  60.33,3.81 180 top
D6-C  66.04,3.81 180 top
FB1-0C  44.45,41.91 0 top
J1-C  106.68,82.55 270 top
J1-CP  32.39,20.32 180 top
J1-CS  92.08,50.8 0 bottom
J2-C  110.11,36.32 0 top
J2-CP  17.78,62.23 270 top
J2-CS  46.99,20.32 180 bottom
J3-CP  17.78,49.53 270 top
J3-CS  80.01,20.32 180 bottom
JA1-C  83.82,38.1 270 top
JA2-C  87.63,38.1 270 top
JP-CP  81.28,83.82 90 top
JP-CS  90.17,83.82 90 bottom
LS1-C  28.57,93.34 270 top
Q1-0C  37.78,15.56 180 top
Q1-LS1C  35.56,94.61 180 top
Q2-0C  49.53,15.88 90 top
Q2-C  59.06,20.95 180 top
Q2-C1  74.93,16.83 0 top
R0-0C  108.9,23.5 270 top
R0A-C  21.59,8.26 270 top
R0B-C  24.13,8.26 270 top
R0C-C  26.67,8.26 270 top
R1-0C  55.25,66.04 90 top
R1-2C  27.17,43.81 90 top
R1-J2C  98.42,37.27 270 top
R1-LS1C  25.4,84.45 0 top
R1-Q0C  43.81,16.51 0 top
R1A-C  34.92,8.26 270 top
R1B-C  32.39,8.26 270 top
R2-2C  29.57,43.81 90 top
R2-J2C  100.97,37.27 90 top
R2-LS1C  44.45,92.08 270 top
R2-Q0C  53.97,15.88 0 top
R2A-C  40.64,8.26 270 top
R2B-C  43.18,8.26 270 top
R3-2C  31.11,52.07 180 top
R3-C  48.89,8.26 270 top
R3-J2C  95.88,37.27 270 top
R4-2C  27.3,55.24 270 top
R4-C  54.61,8.26 270 top
R4-LS1C  40.64,95.89 180 top
R4-LS1C1  40.64,93.34 0 top
R5-C  60.33,8.26 270 top
R6-C  66.04,8.26 270 top
R-Q2C  60.33,25.4 90 top
R-Q2C1  71.12,16.83 180 top
S0-0C  116.84,22.86 90 top
S1-0C  5.08,22.86 270 top
U0-C  60.96,50.8 0 top
U1-C  68.98,71.75 90 top
U2-C  26.67,49.58 270 top
VR1-LS1C  39.37,85.72 90 top
Y1-C  38.73,45.09 90 top

### Tracks (layer width: path | path; a pad name or v marks a point on that pad's centre or on a via)
3V3  (via drill 0.35, 0.85)
  Top 0.254: C5-0C.1 64.71,34.66 U0-C.62 | U0-C.17 45.52,51.55 C1-0C.1 | C11-0C.1 58.71,64.8 U0-C.131 | J1-C.4 99.38,81.28 C1-C.1 | U0-C.6 45.5,57.05 C14-0C.1 | U0-C.39 53.21,35.75 C3-0C.1 | U2-C.8 26.67,46.35 25.08,44.77 C1-2C.1 | C8-0C.1 77.52,59.55 U0-C.108 | U0-C.121 63.71,64.88 C9-0C.1 | U0-C.144 52.21,63.36 | 52.21,63.36 52.21,64.95 C10-0C.1 | U0-C.143 52.71,62.86 52.21,63.36 | C4-0C.1 59.71,35.26 U0-C.52 | U0-C.72 69.71,38.24 70.48,37.47 C12-0C.1 | U0-C.95 75.53,53.05 C7-0C.1 | FB1-0C.1 43.6,41.49 v44.45,40.64 | U1-C.7 68.34,76.6 v68.58,76.83 | U0-C.30 44.73,45.05 C2-0C.1 | Q2-C.2 56.8,23.36 56.8,35.84 v57.15,36.2 | C6-0C.1 75.8,47.55 U0-C.84 v68.97,47.55
  Top 0.381: v72.64,60.58 77.03,60.58 C8-0C.1
  Top 0.508: Q1-0C.2 38.73,18.56 38.73,20.95 53.02,35.24 C3-0C.1 | Q2-C1.2 87.16,15.73 94.3,22.86 v94.3,26.04 | S0-0C.2 v97.87,26.11
  Top 1.016: v95.88,36.2 R3-J2C.2
  Top 2.032: v47.62,58.42 45.72,60.33 v37.47,60.33
  Bottom 0.254: C12-0C.1 68.58,33.97 | v57.15,36.2 57.15,35.88 56.83,35.56
  Bottom 0.381: 53.75,58.01 54.16,58.42 61.28,58.42 70.48,58.42 v72.64,60.58
  Bottom 0.508: C1-C.1 91.12,78.74 JP-CS.1 86.36,78.74 | 85.72,78.74 JP-CP.1 70.48,78.74 v68.58,76.83 58.42,66.67 C11-0C.1 | C13-0C.1 85.72,78.74 | 86.36,78.74 95.88,69.22 | 49.37,62.39 C10-0C.1 C11-0C.1 | 49.37,62.39 46.83,59.85 | 46.83,59.85 45.4,58.42 C14-0C.1 C1-0C.1 44.13,50.16 C2-0C.1 | v29.57,42.87 v27.17,42.87 26.66,42.87 C1-2C.1 23.09,46.44 23.09,53.32 24.92,55.14 26.25,55.14 R4-2C.1 31.43,60.33 v37.47,60.33 | 68.58,33.97 C5-0C.1 C4-0C.1 56.83,35.56 C3-0C.1 53.02,40.64 | 46.83,59.85 47.62,59.05 v47.62,58.42 | 53.02,40.64 53.02,54.09 53.75,54.82 53.75,58.01 49.37,62.39 | v44.45,40.64 53.02,40.64 | 85.72,78.74 86.36,78.74 | C9-0C.1 C11-0C.1 | 95.88,28.09 v97.87,26.11 | 95.88,28.09 v95.88,36.2 95.88,40.01 90.17,45.72 80.33,45.72 C6-0C.1 C7-0C.1 | 95.88,28.09 95.88,27.62 v94.3,26.04 | 61.28,58.42 61.28,53.34 67.07,47.55 v68.97,47.55
  other vias: 96.52,84.14 85.72,80.33 58.42,65.09 52.07,65.09 45.4,57.15 27.3,56.2 27.3,56.2 24.77,44.77 53.02,35.56 58.42,33.97 65.41,33.97 72.08,37.47 45.4,51.44 63.5,65.09 44.13,44.45 77.15,48.9 77.15,51.44
  pour Bottom (no thermals): 60.64,77.47 60.64,78.11 63.67,81.12 92.68,81.12 96.65,85.09 98.42,85.09 98.42,25.88 97.95,25.4 93.98,25.4 76.2,43.5 76.2,51.91 78.74,54.45 84.45,54.45 89.69,59.69 89.69,67.31 79.53,77.47
  pour Bottom (no thermals): 60.64,77.77 60.64,69.53 57.47,66.36 52.64,66.36 44.58,58.29 44.58,51.56 43.18,50.16 43.18,41.27 44.45,40.01 47.62,40.01 54.61,33.02 70.64,33.02 73.5,35.88 73.5,58.58 66.67,51.75 66.04,51.75 65.56,51.28 65.09,51.28 65.09,51.59 73.5,60.01 73.5,63.63 73.48,63.66 69.06,63.66 69.06,64.77 67.71,64.77 67.71,65.33 67.94,65.33 68.18,65.72 68.5,65.72 68.5,66.36 68.9,66.36 69.22,66.04 69.69,66.04 69.69,71.6 73.5,71.6 73.5,73.25 70.8,75.88 70.8,77.15 71.42,77.77
  pour Bottom (no thermals): 42.23,63.18 42.23,71.04 41.83,71.44 11.43,71.44 11.43,50.96 17.94,50.96 26.42,42.42 29.72,42.42 29.97,42.67 29.97,43.05 29.59,43.43 27.69,43.43 23.5,47.62 23.5,53.09 25.15,54.74 33.78,54.74
5V  (via drill 0.35)
  Top 0.508: v65.41,81.28 50.8,81.28 46.36,81.28 VR1-LS1C.A 32.09,83.19 D1-LS1C.A
  Bottom 0.381: JP-CP.2 JP-CS.2
  Bottom 0.508: JP-CP.2 v65.41,81.28
ACCEL_ANALOG  (via drill 0.35)
  Top 0.254: U0-C.46 56.71,42.74 65.26,51.29 v65.26,51.58 | v76.54,65.54 76.54,84.8 79.38,87.63 83.82,87.63 85.09,88.9 JP-CS.5
  Bottom 0.254: v76.54,65.54 74.91,63.91 74.91,61.23 v65.26,51.58
ADC-ERROR
  Top 0.254: R6-C.1 63.21,12.04 U0-C.59
ADC_ALERT  (via drill 0.35)
  Top 0.254: U2-C.2 27.17,54.16 R4-2C.2 35.3,54.3 36.95,52.64 41.02,52.64 v41.27,52.39 | U0-C.98 65.98,54.55 v65.41,53.98 | v42.55,55.24 v48.26,55.24 | v52.71,56.52 v62.86,56.52
  Bottom 0.254: v41.27,52.39 41.27,53.98 v42.55,55.24 | v48.26,55.24 49.55,56.54 52.7,56.54 v52.71,56.52 | v62.86,56.52 v65.41,53.98
ADDR
  Top 0.254: U2-C.1 27.96,52.07 R3-2C.2
ARMED-LED  (via drill 0.35)
  Top 0.254: U0-C.53 60.21,29.11 v59.68,28.58 | v57.15,15.88 R2-Q0C.2
  Bottom 0.254: v59.68,28.58 59.68,28.23 59.67,28.21 59.67,18.39 v57.15,15.88
BATT_MEAS  (via drill 0.35)
  Top 0.254: U0-C.47 57.21,42.6 v66.67,52.07 | v75.88,62.87 75.88,84.77 80.01,88.9 JP-CP.5
  Bottom 0.254: v66.67,52.07 75.88,61.28 v75.88,62.87
BOOT0
  Top 0.254: U0-C.138 55.21,65.06 R1-0C.1
BUZZER_OUT  (via drill 0.35)
  Top 0.254: U0-C.1 49.03,59.55 41.59,66.99 v41.59,81.92
  Bottom 0.254: R4-LS1C1.2 v41.59,81.92
  other vias: 41.59,93.34
CENTRAL-ERROR
  Top 0.254: U0-C.55 61.21,27.3 61.21,27.23 R-Q2C.2
CENTRAL-NOMINAL  (via drill 0.35)
  Top 0.254: R1B-C.1 R1A-C.1 38.44,12.72 v57.15,12.72 | U0-C.54 60.71,28.32 v60.33,27.94
  Bottom 0.254: v57.15,12.72 60.33,15.9 v60.33,27.94
CLK-1
  Top 0.254: U0-C.41 54.21,31.75 54.21,31.35 54.21,25 53.34,24.13 45.72,24.13 J2-CS.1
CLK-3  (via drill 0.35, 0.85)
  Top 0.254: v69.61,74.44 U1-C.6 | U0-C.111 68.71,62.39 69.85,63.53 v69.85,66.67
  Bottom 0.254: 69.85,66.99 v69.85,66.67 69.85,70.8 | v73.66,71.44 70.48,71.44 | 70.48,71.44 70.17,71.44 | 69.61,71.99 70.17,71.44 | v69.61,74.44 69.61,71.99 | 69.85,70.8 69.85,71.12 | 69.85,71.12 69.85,71.28 | 69.85,71.28 69.85,71.44 69.61,71.67 69.61,71.99 | 70.17,71.44 70.01,71.44 69.85,71.28 | 70.48,71.44 69.85,70.8 | 70.17,71.44 69.85,71.12
CS1
  Top 0.254: U0-C.44 55.71,31.11 55.71,30.95 55.71,24.59 53.34,22.23 51.44,22.23 J2-CS.4
CS2
  Top 0.254: J2-CS.5 56.21,24.46 U0-C.45
CS-3  (via drill 0.35, 0.85)
  Top 0.254: U1-C.1 v67.08,66.36 67.08,63.24 67.21,63.11 U0-C.114
  Bottom 0.254: v67.08,66.36 68.9,66.36 69.22,66.04 70.17,66.04 v73.66,69.53
CTS
  Top 0.254: U0-C.34 48.89,43.05 48.77,43.05 46.99,41.27 46.99,37.47 32.39,22.86 30.48,22.86 28.57,20.95 J1-CP.4
D1-LS1C_R1-LS1C
  Top 0.508: D1-LS1C.C 26.38,84.43 R1-LS1C.2
D+
  Top 0.254: U0-C.104 74.97,57.55 76.17,56.35 93.39,56.35 95.88,53.85 95.88,40.52 | R2-J2C.2 100.27,38.22 99.12,39.37 97.03,39.37 95.88,40.52 | 95.88,40.52 R3-J2C.1
D+_R2-J1C
  Top 0.254: R2-J2C.1 J2-C.3
D-
  Top 0.254: U0-C.103 74.89,57.05 76,55.94 93.22,55.94 95.25,53.91 95.25,39.43 94.81,38.99 94.81,37.46 94.97,37.29 97.45,37.29 R1-J2C.2
D-_R1-J1C
  Top 0.254: J2-C.2 102.23,36.97 101.91,37.29 99.35,37.29 R1-J2C.1
DISARM_INPUT
  Top 0.254: U0-C.89 83.3,50.05 91.44,41.91 91.44,31.43 100.33,22.55 109.22,22.55 115.53,22.55 S0-0C.4
  Top 0.508: R0-0C.2 109.22,22.55
DROGUE-LED
  Top 0.254: R3-C.1 51.12,11.43 57.78,11.43 61.71,15.36 U0-C.56
FIRE_A
  Top 0.254: J2-CP.1 19.69,64.14 19.69,62.87 20.32,62.23 29.84,62.23 37.52,54.55 U0-C.11
FIRE_B
  Top 0.254: J2-CP.2 19.69,61.59 29.84,61.59 37.39,54.05 U0-C.12
FIRE_C
  Top 0.254: U0-C.13 37.25,53.55 29.84,60.96 J2-CP.3
FIRE_D
  Top 0.254: U0-C.14 37.12,53.05 29.84,60.33 19.69,60.33 J2-CP.4
GND  (via drill 0.35, 0.85)
  Top 0.254: U0-C.94 74.24,52.55 v75.25,51.55 C7-0C.2 | C17-0C.2 80.64,57.78 v81.75,58.89 80.83,59.82 C8-0C.2 | U0-C.16 46.58,52.05 46.17,52.46 44.53,52.46 C1-0C.2 v41.91,51.44 | U0-C.130 59.21,64.08 59.45,64.32 59.45,65.96 C11-0C.2 | U0-C.38 52.71,37.15 C3-0C.2 v49.53,35.56 | U0-C.31 47.3,44.55 45.92,43.18 43.18,43.18 42.23,44.13 C2-0C.2 | U0-C.61 64.21,33.27 C5-0C.2 v65.41,30.48 | C1-Y1C.2 v31.75,46.35 | C2-Y1C.2 v31.75,43.81 | R3-2C.1 v33.66,52.07 | C16-0C.2 v75.56,34.92 | U0-C.107 76.04,59.05 v76.2,58.89 | C14-0C.2 v41.91,57.15 | v58.42,30.48 C4-0C.2 58.42,32.17 57.39,33.2 57.39,34.74 59.21,36.55 U0-C.51 | R1-0C.2 v55.25,68.58 | U0-C.120 64.21,64 64.53,64.32 64.53,65.96 C9-0C.2 | C10-0C.2 v52.07,68.58 | D0B-C.C D0A-C.C | C12-0C.2 v75.56,37.47 | R2-LS1C.1 44.31,92.88 | U2-C.3 26.67,52.7 v25.4,53.98 | U1-C.8 67.08,82.29 v67.11,82.32 | J2-C.5 v104.14,35.01 | C15-0C.2 7.34,24.13 S1-0C.4 | v76.83,47.31 76.58,47.05 U0-C.83 | C6-0C.2 v75.25,48.77
  Top 0.381: C9-0C.2 C11-0C.2 v58.42,68.58
  Top 0.508: D6-C.C 63.92,2.76 | 63.92,2.76 63.5,2.76 | 63.5,2.76 63.08,2.76 | 63.08,2.76 D5-C.C D4-C.C D3-C.C D2B-C.C D2A-C.C D1A-C.C D1B-C.C D0C-C.C D0B-C.C | 63.5,2.76 v63.5,3.17 | v63.5,3.17 63.08,2.76 | v63.5,3.17 63.92,2.76 | 41.76,96.06 R4-LS1C.1
  Top 2.032: v73.66,76.2 v73.66,83.82
  Bottom 0.254: 44.99,95.79 44.45,96.33 | 27.3,52.07 v25.4,53.98 | 58.42,82.28 58.46,82.32 | 48.66,15.64 18.97,15.64 12.7,21.91 C15-0C.2 | v75.25,51.54 v75.25,51.55 | 76.71,47.31 v76.83,47.31 | R0-0C.1 108.9,28.65 J2-C.S1 | 75.88,46.67 76.2,46.99
  Bottom 0.508: 71.12,30.48 v65.41,30.48 v58.42,30.48 54.61,30.48 v49.53,35.56 | 71.12,30.48 v75.56,34.92 v75.56,37.47 | 71.12,30.48 78.74,22.86 | v75.25,51.55 75.25,57.94 v76.2,58.89 v81.75,58.89 85.09,62.23 85.09,66.04 74.93,76.2 v73.66,76.2 | 36.83,52.07 v41.91,57.15 52.07,67.31 v52.07,68.58 v55.25,68.58 v58.42,68.58 58.42,82.28 | 36.83,52.07 v33.66,52.07 | v33.66,52.07 33.66,48.26 v31.75,46.35 v31.75,43.81 | 47.21,93.57 58.46,82.32 v67.11,82.32 68.61,83.82 v73.66,83.82 | 47.21,93.57 44.99,95.79 44.89,95.89 R4-LS1C.1 37.93,95.89 Q1-LS1C.3 | v33.66,52.07 27.3,52.07 | v63.5,3.17 63.5,9.53 | 63.5,9.53 63.5,15.88 70.48,22.86 78.74,22.86 | 47.21,93.57 47.16,93.52 44.45,93.52 R2-LS1C.1 | 79.1,22.5 78.74,22.86 | Q2-0C.3 48.66,15.64 54.78,9.53 63.5,9.53 | v31.75,43.81 41.59,43.81 C2-0C.2 | v31.75,43.81 31.75,43.5 29.84,41.59 26.04,41.59 v24.77,42.87 | v41.91,51.44 37.47,51.44 36.83,52.07 | v75.25,48.77 C6-0C.2 | C6-0C.2 v75.25,51.54 | v76.83,47.31 75.25,47.31 v75.25,48.77 | v76.83,47.31 C6-0C.2 | v76.83,47.31 75.25,45.72 | 75.25,46.99 75.25,46.35 75.56,46.67 75.56,48.45 v75.25,48.77 | 76.2,47.62 76.2,46.99 | J2-C.S1 105.81,31.75 105.78,31.75 104.14,33.39 v104.14,35.01 | v75.25,48.77 75.88,48.13 75.88,46.67
  Bottom 1.016: J2-C.S2 J2-C.S1 J2-C.S4 J2-C.S3 | 85.72,83.82 JP-CS.3 92.71,83.82 | 85.72,83.82 JP-CP.3 | 85.72,83.82 C13-0C.2 | 74.3,83.82 v73.66,83.82 | C1-C.2 94.93,86.04 92.71,83.82 | J1-C.1 104.14,88.9 100.33,92.71 96.52,92.71 92.71,88.9 92.71,83.82
  other vias: 85.72,82.23 85.72,82.23 96.52,86.04 42.23,44.45 35.56,93.52 41.59,95.89 44.45,93.03 48.43,15.88 108.9,24.45 12.7,24.13
  pour Bottom (no thermals): 71.12,76.04 73.82,73.34 73.82,71.28 70.01,71.28 70.01,66.04 68.82,66.04 68.82,64.77 69.37,64.77 69.37,63.98 73.82,63.98 73.82,59.85 66.36,52.39 66.36,52.07 73.98,59.69 73.98,26.98 86.99,13.97 108.58,13.97 110.49,15.88 110.49,44.45 107,41.59 101.92,37.47 98.74,37.47 98.74,25.72 98.11,25.08 93.82,25.08 75.88,43.32 75.88,52.07 78.74,54.93 84.45,54.93 89.38,59.85 89.38,67.32 79.41,77.15 71.28,77.15 71.12,76.99
  pour Bottom (no thermals): 51.44,89.53 51.44,80.64 42.23,71.44 42.55,71.12 42.55,63.02 33.94,54.42 25.33,54.42 23.88,52.91 23.88,47.75 27.89,43.74 29.69,43.74 30.24,43.18 30.24,42.55 29.84,42.15 26.29,42.15 17.86,50.64 11.43,50.64 11.43,12.06 22.23,1.27 67.63,1.27 68.58,2.22 68.58,11.43 71.12,13.97 86.99,13.97 73.98,26.99 73.98,35.88 70.8,32.7 54.45,32.7 47.47,39.69 44.29,39.69 42.86,41.12 42.86,50.32 44.29,51.75 44.29,58.42 52.55,66.67 57.39,66.67 60.33,69.61 60.33,78.26 64.37,82.31 57.15,89.53
  pour Bottom (no thermals): 40.64,100.33 99.69,100.33 110.49,89.53 110.49,44.45 101.92,37.47 98.74,37.47 98.74,85.72 96.77,85.72 92.49,81.44 63.34,81.44 55.88,88.9 52.07,88.9
  pour Bottom: 40.64,100.33 22.86,100.33 11.43,88.9 11.43,71.75 41.91,71.75 42.23,71.44 51.44,80.64 51.44,89.53
HOLD  (via drill 0.85)
  Top 0.254: U0-C.116 66.21,66.59 65.38,67.42 65.38,72.5 65.42,72.5 66.67,73.76 70.64,73.76 | v73.66,73.34 73.24,73.76 71.12,73.76 | 71.12,73.76 70.64,73.76 | 70.64,73.76 70.89,74 | U1-C.5 70.89,74 | 70.89,74 71.12,73.77 71.12,73.76
ID
  Top 0.254: U0-C.102 74.82,56.55 75.83,55.54 93.05,55.54 94.61,53.98 94.61,39.37 94.4,39.16 94.4,35.96 94.97,35.39 101.88,35.39 102.16,35.67 J2-C.4
LS1-C_Q1-LS1C
  Top 0.508: R1-LS1C.1 24.45,93.03 LS1-C.V- 33.17,97.16 Q1-LS1C.2
MAIN-LED
  Top 0.254: U0-C.57 62.21,15.22 57.78,10.79 56.2,10.79 R4-C.1
MASTER_RX-1
  Top 0.254: J1-CS.1 93.34,52.7 92,54.05 U0-C.97
MASTER_RX-2
  Top 0.254: U0-C.37 52.21,38.88 51.44,38.1 49.53,38.1 33.66,22.23 J1-CP.2
MASTER_TX-1
  Top 0.254: U0-C.96 81.28,53.55 81.47,53.55 89.96,53.55 90.8,52.7 J1-CS.2
MASTER_TX-2
  Top 0.254: U0-C.36 49.03,42.05 48.26,41.27 48.26,37.47 J1-CP.3
MISO-1
  Top 0.254: J2-CS.2 47.62,23.5 53.34,23.5 54.71,24.86 U0-C.42
MISO-3  (via drill 0.35, 0.85)
  Top 0.254: U0-C.112 68.21,63.18 68.58,63.55 v68.58,65.41 68.34,65.64 U1-C.2 68.26,67.77
  Bottom 0.254: v73.66,67.63 71.44,65.41 v68.58,65.41
MOSI-1
  Top 0.254: J2-CS.3 49.53,22.86 53.34,22.86 55.21,24.73 U0-C.43
MOSI-3  (via drill 0.35, 0.85)
  Top 0.254: U1-C.4 70.13,68.61 67.97,68.61 67.71,68.34 v67.71,64.77 U0-C.113
  Bottom 0.254: v67.71,64.77 72.71,64.77 v73.66,65.72
N$1  (via drill 3 pad 4)
  other vias: 15.24,5.08
N$3  (via drill 3 pad 4)
  other vias: 15.24,96.52
N$4  (via drill 3 pad 4)
  other vias: 106.68,96.52
N$5  (via drill 3 pad 4)
  other vias: 106.68,5.08
N$7
  Top 0.254: R-Q2C1.1 72.88,16.83 Q2-C1.1
NRST  (via drill 0.35)
  Top 0.254: v88.27,58.42 88.27,69.85 94.61,76.2 J1-C.6 | v78.74,54.71 v73.66,54.71 | v69.22,53.34 68.6,52.73 65.47,52.73 60.3,47.55 U0-C.25 49.45,47.55 v48.26,46.35 | v42.55,40.64 28.02,26.11 12.78,26.11 C15-0C.1 12.62,26.11 S1-0C.1
  Bottom 0.254: v78.74,54.71 84.55,54.71 v88.27,58.42 | v69.22,53.34 70.58,54.71 v73.66,54.71 | v42.55,40.64 v48.26,46.35
OSC_IN
  Top 0.254: U0-C.23 48.55,48.55 46.36,46.35 39.05,46.35 Y1-C.P$2 38.41,46.35 C1-Y1C.1
OSC_OUT
  Top 0.254: U0-C.24 48.69,48.05 46.36,45.72 41.27,45.72 39.37,43.81 39.05,43.81 Y1-C.P$1 38.41,43.81 C2-Y1C.1
PB12
  Top 0.254: JA1-C.5 82.87,33.02 73.84,42.05 U0-C.73
PB13
  Top 0.254: U0-C.74 74.29,42.55 82.55,34.29 85.41,34.29 86.68,33.02 JA2-C.5
PB14
  Top 0.254: U0-C.75 73.66,43.05 74.42,43.05 75.38,43.05 82.87,35.56 JA1-C.4
PB15
  Top 0.254: U0-C.76 75.83,43.55 82.55,36.83 85.41,36.83 86.68,35.56 JA2-C.4
PD8
  Top 0.254: U0-C.77 76.2,44.05 76.6,44.05 76.92,44.05 82.87,38.1 JA1-C.3
PD9
  Top 0.254: U0-C.78 77.37,44.55 82.55,39.37 85.41,39.37 86.68,38.1 JA2-C.3
PD10
  Top 0.254: JA1-C.2 82.87,40.64 78.46,45.05 U0-C.79
PD11
  Top 0.254: U0-C.80 78.91,45.55 82.55,41.91 85.41,41.91 86.68,40.64 JA2-C.2
PD12
  Top 0.254: JA1-C.1 82.87,43.18 80,46.05 U0-C.81
PD13
  Top 0.254: JA2-C.1 86.68,43.18 83.31,46.55 75.88,46.55 U0-C.82
Q0-C_R0-C
  Top 0.254: R0A-C.1 R0B-C.1 R0C-C.1 31.92,14.46 Q1-0C.3
Q1-0C_R-1Q0C
  Top 0.254: R1-Q0C.1 38.88,16.51 Q1-0C.1
Q2-C_R2-C
  Top 0.254: R2A-C.1 R2B-C.1 46.04,12.06 57.78,12.06 59.06,13.34 Q2-C.3
R0A-C_D0A-C
  Top 0.254: R0A-C.2 D0A-C.A
R0B-C_D0B-C
  Top 0.254: R0B-C.2 D0B-C.A
R0C-C_D0C-C
  Top 0.254: R0C-C.2 D0C-C.A
R1-Q0C_Q2-0C
  Top 0.254: R1-Q0C.2 45.08,16.82 Q2-0C.2
R1A-C_D1A-C
  Top 0.254: R1A-C.2 D1A-C.A
R1B-C_D1B-C
  Top 0.254: R1B-C.2 D1B-C.A
R2-LS1C_LS1C
  Top 0.508: LS1-C.V+ 30.48,89.53 VR1-LS1C.S
R2-Q0C_Q2-0C
  Top 0.254: Q2-0C.1 51.58,15.88 R2-Q0C.1
R2A-C_D2A-C
  Top 0.254: R2A-C.2 D2A-C.A
R2B-C_D2B-C
  Top 0.254: R2B-C.2 D2B-C.A
R3-C_D3-C
  Top 0.254: R3-C.2 D3-C.A
R3-LS1C_Q1-LS1C
  Top 0.508: Q1-LS1C.1 36.68,95.89 R4-LS1C.2 R4-LS1C1.1
R4-C_D4-C
  Top 0.254: R4-C.2 D4-C.A
R5-C_D5-C
  Top 0.254: R5-C.2 D5-C.A
R6-C_D6-C
  Top 0.254: R6-C.2 D6-C.A
R-Q2C_Q2-C
  Top 0.254: Q2-C.1 60.33,22.38 R-Q2C.1
RTS
  Top 0.254: U0-C.35 48.89,42.55 47.62,41.27 47.62,37.47 32.39,22.23 30.48,22.23 29.84,21.59 29.84,19.05 30.48,18.41 34.29,18.41 J1-CP.1
SCL-1  (via drill 0.35)
  Top 0.254: R2-2C.2 29.26,44.77 27.67,46.35 U2-C.10 27.67,47.84 27.94,48.11 28.79,48.11 29.29,47.6 30.46,47.6 30.96,48.11 45.24,48.11 v45.72,47.62 | v52.07,55.88 52.4,55.55 U0-C.100
  Bottom 0.254: v52.07,55.88 45.72,49.53 v45.72,47.62
SDA-1  (via drill 0.35)
  Top 0.254: R1-2C.2 U2-C.9 27.17,48.13 27.56,48.51 28.96,48.51 29.46,48.01 30.28,48.01 30.78,48.51 46.1,48.51 v46.36,48.26 | v52.07,54.61 52.51,55.05 U0-C.99
  Bottom 0.254: v52.07,54.61 46.36,48.9 v46.36,48.26
SENSE_A  (via drill 0.35)
  Top 0.254: U2-C.4 26.17,50.99 27.02,50.14 29.59,50.14 | v24.13,50.39 23.9,50.16 20.95,50.16 J3-CP.1 | 29.59,50.14 30.1,50.14 | 30.1,50.14 46.86,50.14 47.77,51.05 U0-C.18 | 30.1,50.14 v29.84,50.39 29.59,50.14
  Bottom 0.254: v24.13,50.39 v29.84,50.39
SENSE_B
  Top 0.254: U0-C.19 47.95,50.55 47.13,49.73 26.8,49.73 | 26.8,49.73 25.67,50.91 | U2-C.5 25.67,50.91 | 26.8,49.73 24.51,49.73 | 24.51,49.73 18.85,49.73 J3-CP.2 | 25.67,50.91 24.51,49.75 24.51,49.73
  pour Top: 24.54,49.73 26.8,49.73 25.67,50.91
SENSE_C
  Top 0.254: U0-C.20 48.02,50.05 47.3,49.33 26.8,49.33 | 26.8,49.33 25.67,48.2 | U2-C.6 25.67,48.2 | J3-CP.3 18.85,49.33 24.54,49.33 | 24.54,49.33 26.8,49.33 | 25.67,48.2 24.54,49.33
  pour Top: 24.54,49.33 26.8,49.33 25.67,48.2
SENSE_D  (via drill 0.35)
  Top 0.254: U0-C.21 48.1,49.55 47.47,48.92 30.12,48.92 | U2-C.7 26.17,48.13 26.96,48.92 29.21,48.92 29.62,48.92 | 29.62,48.92 29.84,48.92 | 29.84,48.92 30.12,48.92 | 29.84,48.92 29.87,48.9 v29.87,48.67 | v24.13,48.67 23.9,48.9 20.95,48.9 J3-CP.4 | v29.87,48.67 30.12,48.92 | v29.87,48.67 29.62,48.92
  Bottom 0.254: v24.13,48.67 v29.87,48.67
SENSOR-ERROR
  Top 0.254: Q2-C1.3 73.66,19.2 J3-CS.2
SENSOR-ERROR_GPIO
  Top 0.254: U0-C.64 65.71,36 66.87,34.84 66.87,25.21 69.85,22.23 71.75,22.23 72.39,21.59 72.39,19.37 70.17,17.15 R-Q2C1.2
SENSOR-NOMINAL
  Top 0.254: U0-C.63 65.21,35.96 66.43,34.74 66.43,26.67 66.43,26.28 66.43,25.01 J3-CS.1
STORAGE-ERROR
  Top 0.254: R5-C.1 60.33,12.7 62.71,15.09 U0-C.58
SWCLK
  Top 0.254: U0-C.109 70.4,62.23 76.83,62.23 93.34,78.74 93.34,82.87 95.57,85.09 105.41,85.09 J1-C.2
SWDIO
  Top 0.254: U0-C.105 75.04,58.05 76.34,56.76 85.33,56.76 87.31,58.74 87.31,70.17 94.61,77.47 107.64,77.47 108.48,78.31 108.48,80.96 108.48,81.71 108.48,82.02 J1-C.3
SWO  (via drill 0.35)
  Top 0.254: U0-C.133 57.71,60.4 58.42,59.69 v69.85,59.69 | v73.66,61.57 73.66,61.59 73.68,61.57 77.45,61.57 94.61,78.74 J1-C.5
  Bottom 0.254: v69.85,59.69 71.73,61.57 v73.66,61.57
U1S-CHECK
  Top 0.254: U0-C.65 66.21,36.11 67.25,35.07 67.25,25.46 69.85,22.86 73.66,22.86 J3-CS.3
U2S-CHECK
  Top 0.254: U0-C.66 66.71,36.18 67.65,35.24 67.65,25.69 69.85,23.5 75.56,23.5 J3-CS.4
U2S-ST
  Top 0.254: U0-C.69 68.21,36.41 68.87,35.75 68.87,27.94 68.87,27.65 68.87,26.38 69.85,25.4 81.28,25.4 J3-CS.7
U3S-CHECK
  Top 0.254: U0-C.67 67.21,36.26 68.06,35.41 68.06,27.3 68.06,27.19 68.06,25.92 69.85,24.13 77.47,24.13 J3-CS.5
U4S-CHECK
  Top 0.254: U0-C.68 67.71,36.33 68.47,35.58 68.47,26.15 69.85,24.77 79.38,24.77 J3-CS.6
US2-STATUS
  Top 0.254: U0-C.70 68.71,36.48 69.28,35.91 69.28,26.61 69.85,26.04 83.19,26.04 J3-CS.8
VCAP_1
  Top 0.254: U0-C.71 69.22,36.83 71.12,34.92 C16-0C.1
VCAP_2
  Top 0.254: U0-C.106 75.44,58.55 76.2,57.78 C17-0C.1
VDDA
  Top 0.254: FB1-0C.2 46.94,43.55 | 46.94,43.55 U0-C.33 | U0-C.32 47.44,44.05 46.94,43.55
VR1-LS1C_R3-LS1C
  Top 0.254: 44.45,90.81 R2-LS1C.2
  Top 0.508: VR1-LS1C.E 44.45,90.81
VUSB  (via drill 0.35)
  Top 0.254: J2-C.1 103.98,37.62 96.52,45.09 96.52,60.33 v89.53,67.31 | JP-CP.4 81.28,86.06 79.48,84.25 79.48,77.37 v84.45,72.39
  Bottom 0.254: v89.53,67.31 v84.45,72.39
WP  (via drill 0.35, 0.85)
  Top 0.254: U0-C.115 v66.71,60.33 | U1-C.3 69.22,67.45 v69.22,63.82
  Bottom 0.254: v66.71,60.33 66.71,61.31 v69.22,63.82 v73.66,63.82

### Text on the board
tNames: Purdue Space Program Solids / SRAD CPr Prototype 1.1 | 1 | 1 | 2 | 3 | 4 | 5 | 6 | HOLD | CLK-3 | SWD | CS-3 | GND | 1 | 1 | MISO-3 | SWCLK | 2 | MOSI-3 | SWDIO | 3 | 3V3 | 4 | WP | SWO | 5 | NRST | 6 | MBATISTICH JKAJI MPARAL | PD12 | PD13 | PD10 | PD11 | PD8 | PD9 | PB14 | PB15 | PB12 | PB13 | AUX GPIO | UART-2 Test | SPI-1 Test | MISO-1 | MOSI-1 | TX-2 | RX-2 | CLK-1 | RTS | CS1 | CS2 | CTS | RESET | DISARM | ARMED | C Nominal | C Error | Drogue Chute | Main Chute | Storage Error | ADC Error
bNames: Purdue Space Program Solids / SRAD CPr Prototype 1.1 | HOLD | CLK-3 | CS-3 | MISO-3 | MOSI-3 | WP | MBATISTICH JKAJI MPARAL | PD12 | PD13 | PD10 | PD11 | PD8 | PD9 | PB14 | PB15 | PB12 | PB13 | AUX GPIO